# Altium project RK3576J-MB.PrjPCB (part 7 of 7)

## Sheet mPCIe_LoRa_LTE_RS.SchDoc
size 420 x 297 mm; Scale: 1:1; DocumentType: Схема электрическая принципиальная; SheetNumber: 15; SheetTotal: 23; DocumentTypeShort: Э3; DocumentInvertoryNumber: ㅤ
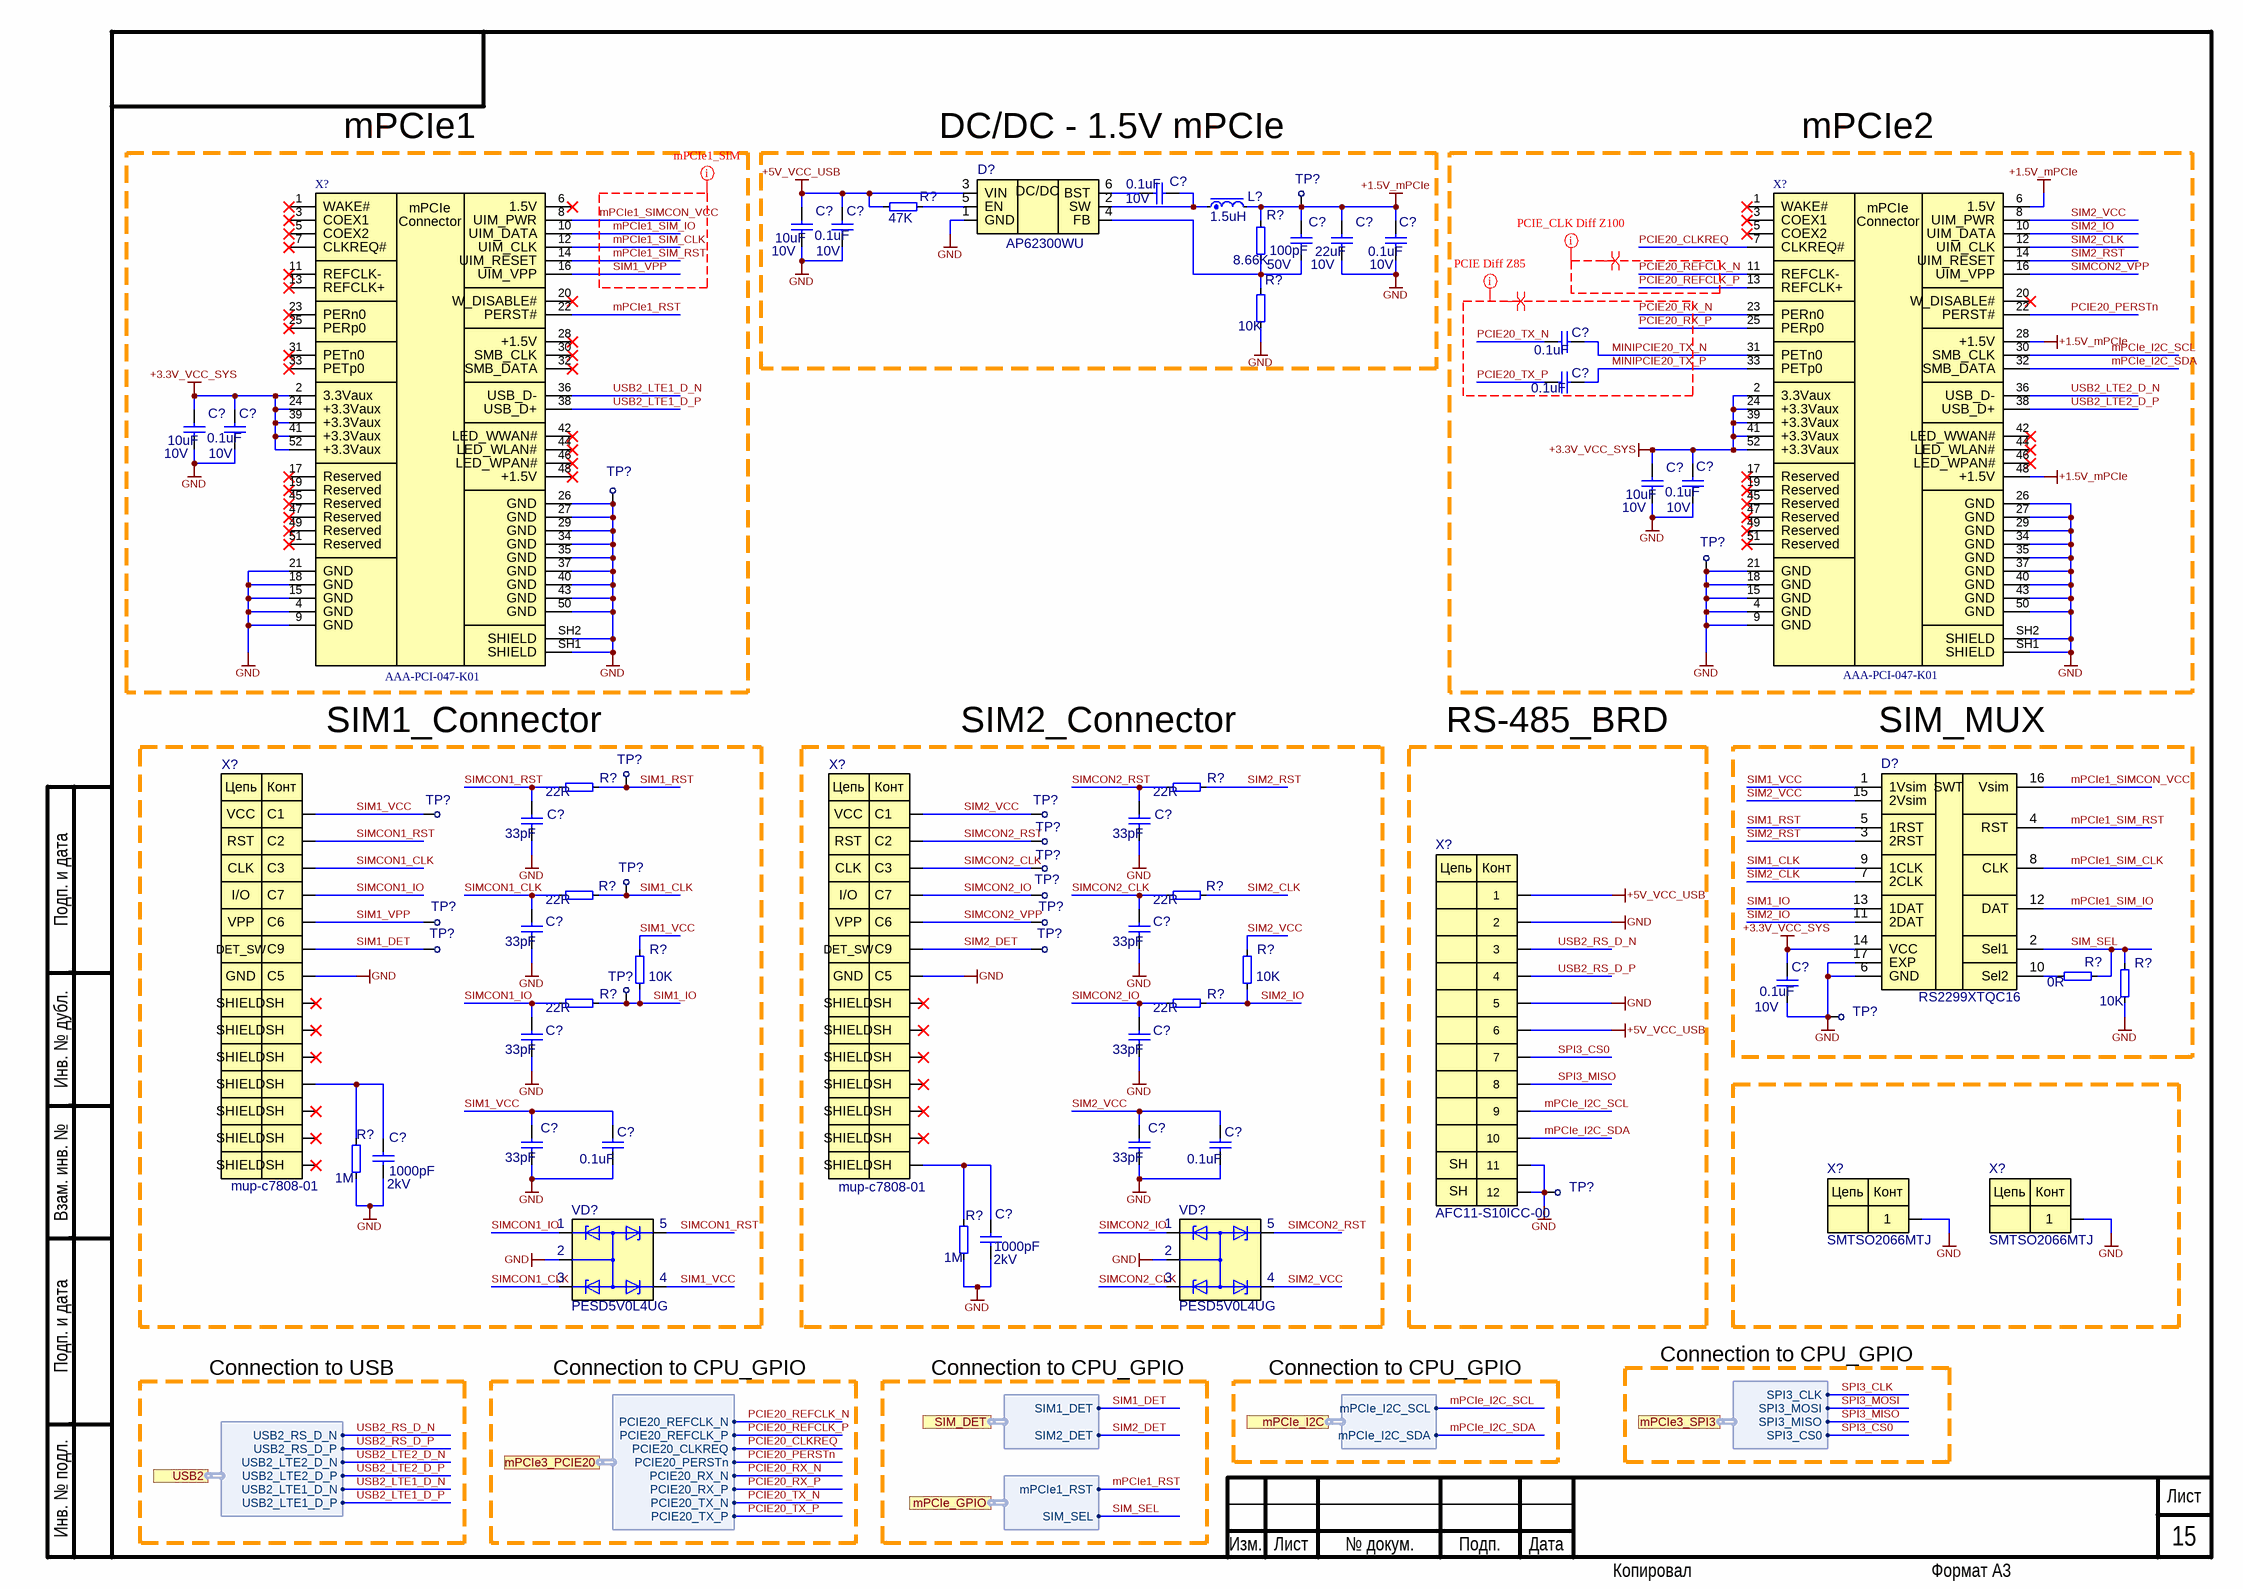
[diagram p23: mPCIe_LoRa_LTE_RS.SchDoc]

### Parts
(Parts that share a designator on the sheet are numbered #1, #2 ... from top to bottom, then left to right.)
C?#1  0.1uF  Voltage: 10V  [C0402]
C?#2  100pF  Voltage: 50V  [C0402]
C?#3  10uF  Voltage: 10V  [C0402]
C?#4  0.1uF  Voltage: 10V  [C0402]
C?#5  22uF  Voltage: 10V  [C0603]
C?#6  0.1uF  Voltage: 10V  [C0402]
C?#7  0.1uF  [C0201]
C?#8  0.1uF  [C0201]
C?#9  10uF  Voltage: 10V  [C0402]
C?#10  0.1uF  Voltage: 10V  [C0402]
C?#11  10uF  Voltage: 10V  [C0402]
C?#12  0.1uF  Voltage: 10V  [C0402]
C?#13  33pF  [C0402]
C?#14  33pF  [C0402]
C?#15  33pF  [C0402]
C?#16  33pF  [C0402]
C?#17  0.1uF  Voltage: 10V  [C0402]
C?#18  33pF  [C0402]
C?#19  33pF  [C0402]
C?#20  33pF  [C0402]
C?#21  0.1uF  [C0402]
C?#22  33pF  [C0402]
C?#23  0.1uF  [C0402]
C?#24  1000pF  Voltage: 2kV  [C1206]
C?#25  1000pF  Voltage: 2kV  [C1206]
D?#1  AP62300WU  [TSOT26]
D?#2  RS2299XTQC16  [RS2299XTQC16]
L?#1  1.5uH  [L1210]
R?#1  47K  [R_0402]
R?#2  8.66K  [R_0402]
R?#3  10K  [R_0402]
R?#4  22R  [R_0402]
R?#5  22R  [R_0402]
R?#6  22R  [R_0402]
R?#7  22R  [R_0402]
R?#8  0R  [R_0402]
R?#9  10K  [R_0402]
R?#10  10K  [R_0402]
R?#11  22R  [R_0402]
R?#12  22R  [R_0402]
R?#13  10K  [R_0402]
R?#14  1M  [R_1206]
R?#15  1M  [R_1206]
TP?#1  Тестовая точка  [TEST]  (value not drawn)  (no BOM)
TP?#2  Тестовая точка  [TEST]  (value not drawn)  (no BOM)
TP?#3  Тестовая точка  [TEST]  (value not drawn)  (no BOM)
TP?#4  Тестовая точка  [TEST]  (value not drawn)  (no BOM)
TP?#5  Тестовая точка  [TEST]  (value not drawn)  (no BOM)
TP?#6  Тестовая точка  [TEST]  (value not drawn)  (no BOM)
TP?#7  Тестовая точка  [TEST]  (value not drawn)  (no BOM)
TP?#8  Тестовая точка  [TEST]  (value not drawn)  (no BOM)
TP?#9  Тестовая точка  [TEST]  (value not drawn)  (no BOM)
TP?#10  Тестовая точка  [TEST]  (value not drawn)  (no BOM)
TP?#11  Тестовая точка  [TEST]  (value not drawn)  (no BOM)
TP?#12  Тестовая точка  [TEST]  (value not drawn)  (no BOM)
TP?#13  Тестовая точка  [TEST]  (value not drawn)  (no BOM)
TP?#14  Тестовая точка  [TEST]  (value not drawn)  (no BOM)
TP?#15  Тестовая точка  [TEST]  (value not drawn)  (no BOM)
TP?#16  Тестовая точка  [TEST]  (value not drawn)  (no BOM)
TP?#17  Тестовая точка  [TEST]  (value not drawn)  (no BOM)
VD?#1  PESD5V0L4UG  [TSSOP5-5]
VD?#2  PESD5V0L4UG  [TSSOP5-5]
X?#1  AAA-PCI-047-K01  [AAA-PCI-047-K01]
X?#2  AAA-PCI-047-K01  [AAA-PCI-047-K01]
X?#3  mup-c7808-01  [mup-c7808]
X?#4  mup-c7808-01  [mup-c7808]
X?#5  AFC11-S10ICC-00  [AFC11-S10ICC-00]
X?#6  SMTSO2066MTJ  [SMTSO2066MTJ]
X?#7  SMTSO2066MTJ  [SMTSO2066MTJ]

### Ports
mPCIe3_PCIE20 (harness mPCIe3_PCIE20), mPCIe3_SPI3 (harness mPCIe3_SPI3), mPCIe_GPIO (harness mPCIe_GPIO), mPCIe_I2C (harness mPCIe_I2C), SIM_DET (harness SIM_DET), USB2 (harness USB2)

### Harnesses
USB2: USB2_RS_D_P, USB2_RS_D_N, USB2_LTE2_D_P, USB2_LTE2_D_N, USB2_LTE1_D_P, USB2_LTE1_D_N
mPCIe3_PCIE20: PCIE20_REFCLK_P, PCIE20_REFCLK_N, PCIE20_RX_P, PCIE20_RX_N, PCIE20_TX_P, PCIE20_TX_N, PCIE20_PERSTn, PCIE20_CLKREQ
mPCIe_GPIO: SIM_SEL, mPCIe1_RST
SIM_DET: SIM1_DET, SIM2_DET
mPCIe_I2C: mPCIe_I2C_SDA, mPCIe_I2C_SCL
mPCIe3_SPI3: SPI3_MOSI, SPI3_CS0, SPI3_MISO, SPI3_CLK

### Nets
+1.5V_mPCIe: C?#2.1 C?#5.2 C?#6.2 L?#1.2 R?#2.2 TP?#1.1 X?#2.6(1.5V) X?#2.28(+1.5V) X?#2.48(+1.5V)
+3.3V_VCC_SYS: C?#9.2 C?#10.2 C?#11.2 C?#12.2 C?#17.2 D?#2.14(VCC) X?#1.2(3.3Vaux) X?#1.24(+3.3Vaux) X?#1.39(+3.3Vaux) X?#1.41(+3.3Vaux) X?#1.52(+3.3Vaux) X?#2.2(3.3Vaux) X?#2.24(+3.3Vaux) X?#2.39(+3.3Vaux) X?#2.41(+3.3Vaux) X?#2.52(+3.3Vaux)
+5V_VCC_USB: C?#3.2 C?#4.2 D?#1.3(VIN) R?#1.2 X?#5.1 X?#5.6
GND: C?#3.1 C?#4.1 C?#5.1 C?#6.1 C?#9.1 C?#10.1 C?#11.1 C?#12.1 C?#13.1 C?#14.1 C?#15.1 C?#16.1 C?#17.1 C?#18.1 C?#19.1 C?#20.1 C?#21.1 C?#22.1 C?#23.1 C?#24.1 C?#25.1 D?#1.1(GND) D?#2.6(GND) D?#2.17(EXP) R?#3.1 R?#13.1 R?#14.1 R?#15.1 TP?#2.1 TP?#3.1 TP?#16.1 TP?#17.1 VD?#1.2 VD?#2.2 X?#1.4(GND) X?#1.9(GND) X?#1.15(GND) X?#1.18(GND) X?#1.21(GND) X?#1.26(GND) X?#1.27(GND) X?#1.29(GND) X?#1.34(GND) X?#1.35(GND) X?#1.37(GND) X?#1.40(GND) X?#1.43(GND) X?#1.50(GND) X?#1.SH1(SHIELD) X?#1.SH2(SHIELD) X?#2.4(GND) X?#2.9(GND) X?#2.15(GND) X?#2.18(GND) X?#2.21(GND) X?#2.26(GND) X?#2.27(GND) X?#2.29(GND) X?#2.34(GND) X?#2.35(GND) X?#2.37(GND) X?#2.40(GND) X?#2.43(GND) X?#2.50(GND) X?#2.SH1(SHIELD) X?#2.SH2(SHIELD) X?#3.C5 X?#4.C5 X?#5.2 X?#5.5 X?#5.11 X?#5.12 X?#6.1 X?#7.1
MINIPCIE20_TX_N: C?#7.2 X?#2.31(PETn0)
MINIPCIE20_TX_P: C?#8.2 X?#2.33(РЕТр0)
mPCIe1_RST: X?#1.22(PERST#) ; port mPCIe_GPIO.mPCIe1_RST
mPCIe1_SIM_CLK: D?#2.8(CLK) X?#1.12(UIM_CLK)
mPCIe1_SIM_IO: D?#2.12(DAT) X?#1.10(UIM_DATA)
mPCIe1_SIM_RST: D?#2.4(RST) X?#1.14(UIM_RESET)
mPCIe1_SIMCON_VCC: D?#2.16(Vsim) X?#1.8(UIM_PWR)
mPCIe_I2C_SCL: X?#2.30(SMB_CLK) X?#5.9 ; port mPCIe_I2C.mPCIe_I2C_SCL
mPCIe_I2C_SDA: X?#2.32(SMB_DATA) X?#5.10 ; port mPCIe_I2C.mPCIe_I2C_SDA
PCIE20_CLKREQ: X?#2.7(CLKREQ#) ; port mPCIe3_PCIE20.PCIE20_CLKREQ
PCIE20_PERSTn: X?#2.22(PERST#) ; port mPCIe3_PCIE20.PCIE20_PERSTn
PCIE20_REFCLK_N: X?#2.11(REFCLK-) ; port mPCIe3_PCIE20.PCIE20_REFCLK_N
PCIE20_REFCLK_P: X?#2.13(REFCLK+) ; port mPCIe3_PCIE20.PCIE20_REFCLK_P
PCIE20_RX_N: X?#2.23(PERn0) ; port mPCIe3_PCIE20.PCIE20_RX_N
PCIE20_RX_P: X?#2.25(PERp0) ; port mPCIe3_PCIE20.PCIE20_RX_P
PCIE20_TX_N: C?#7.1 ; port mPCIe3_PCIE20.PCIE20_TX_N
PCIE20_TX_P: C?#8.1 ; port mPCIe3_PCIE20.PCIE20_TX_P
SIM1_CLK: D?#2.9(1CLK) R?#6.2 TP?#9.1
SIM1_DET: TP?#13.1 X?#3.C9 ; port SIM_DET.SIM1_DET
SIM1_IO: D?#2.13(1DAT) R?#9.1 R?#11.2 TP?#15.1
SIM1_RST: D?#2.5(1RST) R?#4.2 TP?#4.1
SIM1_VCC: C?#20.2 C?#21.2 D?#2.1(1Vsim) R?#9.2 TP?#5.1 VD?#1.4 X?#3.C1
SIM1_VPP: TP?#11.1 X?#1.16(UIM_VPP) X?#3.C6
SIM2_CLK: D?#2.7(2CLK) R?#7.2 X?#2.12(UIM_CLK)
SIM2_DET: TP?#14.1 X?#4.C9 ; port SIM_DET.SIM2_DET
SIM2_IO: D?#2.11(2DAT) R?#10.1 R?#12.2 X?#2.10(UIM_DATA)
SIM2_RST: D?#2.3(2RST) R?#5.2 X?#2.14(UIM_RESET)
SIM2_VCC: C?#22.2 C?#23.2 D?#2.15(2Vsim) R?#10.2 TP?#6.1 VD?#2.4 X?#2.8(UIM_PWR) X?#4.C1
SIM_SEL: D?#2.2(Sel1) R?#8.2 R?#13.2 ; port mPCIe_GPIO.SIM_SEL
SIMCON1_CLK: C?#15.2 R?#6.1 VD?#1.3 X?#3.C3
SIMCON1_IO: C?#18.2 R?#11.1 VD?#1.1 X?#3.C7
SIMCON1_RST: C?#13.2 R?#4.1 VD?#1.5 X?#3.C2
SIMCON2_CLK: C?#16.2 R?#7.1 TP?#8.1 VD?#2.3 X?#4.C3
SIMCON2_IO: C?#19.2 R?#12.1 TP?#10.1 VD?#2.1 X?#4.C7
SIMCON2_RST: C?#14.2 R?#5.1 TP?#7.1 VD?#2.5 X?#4.C2
SIMCON2_VPP: TP?#12.1 X?#2.16(UIM_VPP) X?#4.C6
SPI3_CLK: port mPCIe3_SPI3.SPI3_CLK
SPI3_CS0: X?#5.7 ; port mPCIe3_SPI3.SPI3_CS0
SPI3_MISO: X?#5.8 ; port mPCIe3_SPI3.SPI3_MISO
SPI3_MOSI: port mPCIe3_SPI3.SPI3_MOSI
USB2_LTE1_D_N: X?#1.36(USB_D-) ; port USB2.USB2_LTE1_D_N
USB2_LTE1_D_P: X?#1.38(USB_D+) ; port USB2.USB2_LTE1_D_P
USB2_LTE2_D_N: X?#2.36(USB_D-) ; port USB2.USB2_LTE2_D_N
USB2_LTE2_D_P: X?#2.38(USB_D+) ; port USB2.USB2_LTE2_D_P
USB2_RS_D_N: X?#5.3 ; port USB2.USB2_RS_D_N
USB2_RS_D_P: X?#5.4 ; port USB2.USB2_RS_D_P
NetC?#1_1: C?#1.1 D?#1.2(SW) L?#1.1
NetC?#1_2: C?#1.2 D?#1.6(BST)
NetC?#2_2: C?#2.2 D?#1.4(FB) R?#2.1 R?#3.2
NetC?#24_2: C?#24.2 R?#14.2 X?#3.SH4(SH)
NetC?#25_2: C?#25.2 R?#15.2 X?#4.SH7(SH)
NetD?#1_5: D?#1.5(EN) R?#1.1
NetD?#2_10: D?#2.10(Sel2) R?#8.1

Not connected (* = marked no-connect by the designer): X?#1 1(WAKE#)* 3(СОЕХ1)* 5(СОЕХ2)* 6(1.5V)* 7(CLKREQ#)* 11(REFCLK-)* 13(REFCLK+)* 17(Reserved)* 19(Reserved)* 20(W_DISABLE#)* 23(PERn0)* 25(PERp0)* 28(+1.5V)* 30(SMB_CLK)* 31(PETn0)* 32(SMB_DATA)* 33(РЕТр0)* 42(LED_WWAN#)* 44(LED_WLAN#)* 45(Reserved)* 46(LED_WPAN#)* 47(Reserved)* 48(+1.5V)* 49(Reserved)* 51(Reserved)*; X?#2 1(WAKE#)* 3(СОЕХ1)* 5(СОЕХ2)* 17(Reserved)* 19(Reserved)* 20(W_DISABLE#)* 42(LED_WWAN#)* 44(LED_WLAN#)* 45(Reserved)* 46(LED_WPAN#)* 47(Reserved)* 49(Reserved)* 51(Reserved)*; X?#3 SH1(SH)* SH2(SH)* SH3(SH)* SH5(SH)* SH6(SH)* SH7(SH)*; X?#4 SH1(SH)* SH2(SH)* SH3(SH)* SH4(SH)* SH5(SH)* SH6(SH)*

### Layout directives
net class mPCIe1_SIM: mPCIe1_SIM_CLK, mPCIe1_SIM_IO, mPCIe1_SIM_RST, mPCIe1_SIMCON_VCC, SIM1_VPP
rule Differential Pairs Routing [Pref Gap = 0.127mm    Min Gap  = 0.127mm    Max Gap  = 0.127mmPref Width = 0.12mm    Min Width  = 0.12mm    Max Width  = 0.14mm]; net class PCIE_Z85: MINIPCIE20_TX_N, MINIPCIE20_TX_P, PCIE20_RX_N, PCIE20_RX_P, PCIE20_TX_N, PCIE20_TX_P
differential pair: MINIPCIE20_TX_N, MINIPCIE20_TX_P, PCIE20_REFCLK_N, PCIE20_REFCLK_P, PCIE20_RX_N, PCIE20_RX_P, PCIE20_TX_N, PCIE20_TX_P
rule Differential Pairs Routing [Pref Gap = 0.2mm    Min Gap  = 0.127mm    Max Gap  = 0.24mmPref Width = 0.11mm    Min Width  = 0.1mm    Max Width  = 0.12mm]; net class PCIE_CLK: PCIE20_REFCLK_N, PCIE20_REFCLK_P

### Notes on the sheet
- mPCIe1
- DC/DC - 1.5V mPCIe
- mPCIe2
- SIM1_Connector
- SIM2_Connector
- RS-485_BRD
- SIM_MUX
- Connection to USB
- Connection to CPU_GPIO
- Подп. и дата
- Инв. № дубл.
- Взам. инв. №
- Инв. № подл.
- Изм.
- Лист
- № докум.
- Подп.
- Дата
- Копировал
- Формат А3
- (in symbol AAA-PCI-047-K01) mPCIe; Connector
- (in symbol AFC11-S10ICC-00) Цепь; Конт; SH
- (in symbol AP62300WU) DC/DC
- (in symbol mup-c7808) Цепь; Конт; VCC; RST; CLK; I/O; VPP; DET_SW; GND; SHIELD
- (in symbol RS2299XTQC16) SWT
- (in symbol SMTSO2066MTJ) Цепь; Конт

### Library data of the parts
C?#1 C?#4 C?#6 C?#10 C?#12 C?#17 = 0402-X7R-16V-0.1uF±10%: Part Number: 0402-X5R-10V-0.1uF±10%; Manufacturer: Yageo; NameFromManufacturer: CC0402KRX5R6BB104; Place: S; Tolerance: 10%; Check: False; Value: 0.1uF; Temperature: -55°C~125°C; ComponentLink2Description: Link to datasheet; ComponentLink1Description: DATASHEET; Last changed: 27.10.2022
C?#2 = 0402-NP0-50V-100pF±5%: *; Manufacturer: Yageo; NameFromManufacturer: CC0402JRNPO9BN101; Place: S; Tolerance: 5%; Check: False; Part Number: 0402-NP0-50V-100pF±5%; Value: 100pF; Temperature: -55°C~125°C; ComponentLink2Description: Link to datasheet; ComponentLink1Description: DATASHEET; ComponentLink2URL: https://www.terraelectronica.ru/product/367375; ComponentLink1URL: Datasheets/capacitors/UPY-GP_NP0_16V-to-50V_18.pdf; Last changed: 27.10.2022
C?#3 C?#9 C?#11 = 0402-X5R-10V-10uF±20: *; Manufacturer: Samsung; NameFromManufacturer: CL05A106MP5NUNC; Place: S; Tolerance: 20%; Check: False; Part Number: 0402-X5R-10V-10uF±20; Value: 10uF; Temperature: -55°C~85°C; ComponentLink2Description: Link to datasheet; ComponentLink1Description: DATASHEET; Last changed: 06.04.2023
C?#5 = 0603-X5R-10V-22uF±20%: *; Manufacturer: Murata; NameFromManufacturer: GRM188R61A226ME15D; Place: S; Tolerance: 20%; Part Number: 0603-X5R-10V-22uF±20%; Value: 22uF; Temperature: -55°C~85°C; ComponentLink2Description: Link to datasheet; ComponentLink1Description: DATASHEET
C?#7 C?#8 = 0201-X5R-25V-0.1uF±10%: Manufacturer: Yageo; NameFromManufacturer: CC0201KRX5R8BB104; Place: S; Voltage: 25V; Tolerance: 10%; Check: False; Part Number: 0201-X5R-25V-0.1uF±10%; Value: 0.1uF; Temperature: -55°C~85°C; ComponentLink2Description: Link to datasheet; ComponentLink1Description: DATASHEET; ComponentLink2URL: https://octopart.com/cc0201krx5r8bb104-yageo-88496683?r=sp; ComponentLink1URL: Datasheets/capacitors/UPY-GPHC_X5R_4V-to-50V_26.pdf; Last changed: 27.10.2022
C?#13-C?#16 C?#18-C?#20 C?#22 = 0402-NP0-50V-033pF±5%: Manufacturer: Yageo; NameFromManufacturer: CC0402JRNPO9BN330; Place: S; Voltage: 50V; Tolerance: 5%; Check: False; Annotation: *; Param: *; Value: 33pF; Part Number: 0402-NP0-50V-033pF±5%; Temperature: -55°C~125°C; ComponentLink1Description: DATASHEET; ComponentLink1URL: https://ru.mouser.com/ProductDetail/YAGEO/CC0402JRNPO9BN330?qs=%2Fha2pyFadugad28DmURO4SjHY55hse1%2FbIxH0hu%252BjwDDDqlPhfn26g%3D%3D; Datasheet: #https://www.yageo.com/upload/media/product/productsearch/datasheet/mlcc/UPY-GP_NP0_16V-to-50V_18.pdf#; Last changed: 07.10.2021
C?#21 C?#23 = 0402-X7R-16V-0.1uF±10%: Manufacturer: Yageo; NameFromManufacturer: CC0402JRX7R7BB104; Place: S; Voltage: 16V; Tolerance: 10%; Check: False; Annotation: *; Param: *; Value: 0.1uF; Part Number: 0402-X7R-16V-0.1uF±10%; Temperature: -55°C~125°C; ComponentLink1Description: DATASHEET; ComponentLink1URL: https://www.yageo.com/upload/media/product/productsearch/datasheet/mlcc/UPY-GPHC_X7R_6.3V-to-50V_18.pdf; Datasheet: #https://www.yageo.com/upload/media/product/productsearch/datasheet/mlcc/UPY-GPHC_X7R_6.3V-to-50V_18.pdf#; Last changed: 31.03.2021
C?#24 C?#25 = 1206-X7R-2K-1000pF±10%: Manufacturer: Walsin; NameFromManufacturer: 1206B102K202; Place: S; Tolerance: 10%; Check: False; Part Number: 1206-X7R-2K-1000pF±10%; Value: 1000pF; Temperature: -55°C~125°C; ComponentLink2Description: Link to datasheet; ComponentLink1Description: DATASHEET; ComponentLink2URL: https://www.lcsc.com/product-detail/Multilayer-Ceramic-Capacitors-MLCC-SMD-SMT_Walsin-Tech-Corp-1206B102K202_C77494.html; ComponentLink1URL: Datasheets/capacitors/1810261813_Walsin-Tech-Corp-1206B102K202_C77494.pdf#Datasheets/capacitors/1810261813_Walsin-Tech-Corp-1206B102K202_C77494.pdf#; Last changed: 05.12.2022
D?#1 = AP62300WU: 4.2V TO 18V INPUT, 3A LOW IQ SYNCHRONOUS BUCK CONVERTER; Manufacturer: Diodes Incorporated; Place: S; Check: False; Part Number: AP62300WU; Value: AP62300WU; Temperature: -40°C~125°C; NameFromManufacturer: AP62300WU; ComponentLink1Description: DATASHEET; ComponentLink1URL: https://ru.mouser.com/ProductDetail/Diodes-Incorporated/AP62300WU-7?qs=vHuUswq2%252Bsy87v186OJS%2FQ%3D%3D; Datasheet: Datasheets/power/AP62300_AP62301_AP62300T.pdf; Last changed: 27.10.2022
D?#2 = RS2299XTQC16: Analog Switches; Manufacturer: RUNIC Tech; Check: False; Part Number: RS2299XTQC16; Value: RS2299XTQC16; NameFromManufacturer: RS2299XTQC16
L?#1 = 1210-1A-1.5uH±20%: *; Manufacturer: Taiyo Yuden; NameFromManufacturer: LBC3225T1R5MR; Place: S; Tolerance: 20%; Current: 1A; DC Resistance: 0.060R; Check: False; Part Number: 1210-1A-1.5uH±20%; Value: 1.5uH; Temperature: -40°C~105°C; ComponentLink1Description: DATASHEET; ComponentLink1URL: https://www.electronshik.ru/item/TAIYO/LBC3225T1R5MR; Datasheet: Datasheets/inductors/LSQCA322525T1R5MRSS.pdf; Last changed: 27.10.2022
R?#1 = 0402-0.0625W-47K-100ppm±1%: NameFromManufacturer: RC0402FR-0747KL; Manufacturer: Yageo; Place: S; Tolerance: 1%; Check: False; Part Number: 0402-0.0625W-47K-100ppm±1%; Value: 47K; Temperature: -55°C~155°C; ComponentLink1Description: DATASHEET; ComponentLink1URL: https://www.terraelectronica.ru/pdf/show?pdf_file=%252Fds%252Fpdf%252FR%252FRC0402.pdf; Datasheet: Datasheets/resistors/PYu-RC_Group_51_RoHS_L_12.pdf; Last changed: 27.10.2022
R?#2 = 0402-0.0625W-48.7K-100ppm±1%: Part Number: 0402-0.0625W-8.66K-100ppm±1%; NameFromManufacturer: RC0402FR-078K66L; Manufacturer: Yageo; Place: S; Tolerance: 1%; Check: False; Value: 8.66K; Temperature: -55°C~155°C; ComponentLink1Description: DATASHEET; ComponentLink1URL: https://www.terraelectronica.ru/product/1871035; Datasheet: Datasheets/resistors/PYu-RC_Group_51_RoHS_L_12.pdf; Last changed: 27.10.2022
R?#3 = 0402-0.0625W-10K-100ppm±1%: NameFromManufacturer: RC0402FR-0710KL; Manufacturer: Yageo; Place: S; Tolerance: 1%; Check: False; Part Number: 0402-0.0625W-10K-100ppm±1%; Value: 10K; Temperature: -55°C~155°C; ComponentLink1Description: DATASHEET; ComponentLink1URL: https://ru.mouser.com/ProductDetail/YAGEO/RC0402FR-0710KL?qs=%2Fha2pyFaduhjtLcYvKXQ8IogF7YwN7YtH%252BOO8ZtEEMnoa4yoWYcwpw%3D%3D; Datasheet: Datasheets/resistors/PYu-RC_Group_51_RoHS_L_11.pdf; Last changed: 27.10.2022
R?#4-R?#7 R?#11 R?#12 = 0402-0.0625W-22R-100ppm±1%: NameFromManufacturer: RC0402FR-0722RL; Manufacturer: Yageo; Place: S; Tolerance: 1%; Check: False; Annotation: *; Param: *; Value: 22R; Part Number: 0402-0.0625W-22R-100ppm±1%; Temperature: -55°C~155°C; ComponentLink1Description: DATASHEET; ComponentLink1URL: https://www.yageo.com/upload/media/product/productsearch/datasheet/rchip/PYu-RC_Group_51_RoHS_L_11.pdf; Datasheet: #https://www.yageo.com/upload/media/product/productsearch/datasheet/rchip/PYu-RC_Group_51_RoHS_L_11.pdf#; Last changed: 10.06.2021
R?#8 = 0402-0.0625W-0R-100ppm±1%: NameFromManufacturer: RC0402FR-070RL; Manufacturer: Yageo; Place: S; Tolerance: 1%; Check: False; Part Number: 0402-0.0625W-0R-100ppm±1%; Value: 0R; Temperature: -55°C~155°C; ComponentLink1Description: DATASHEET; ComponentLink1URL: https://www.chipdip.ru/product0/8000617426?ysclid=l7og5x0plo427794326; Datasheet: Datasheets/resistors/DOC012445956.pdf; Last changed: 27.10.2022
R?#9 R?#10 R?#13 = 0402-0.0625W-10K-100ppm±5%: NameFromManufacturer: RC0402JR-0710KL; Manufacturer: Yageo; Place: S; Tolerance: 5%; Check: False; Annotation: *; Param: *; Value: 10K; Part Number: 0402-0.0625W-10K-100ppm±5%; Temperature: -55°C~155°C; ComponentLink1Description: DATASHEET; ComponentLink1URL: https://ru.mouser.com/ProductDetail/YAGEO/RC0402JR-0710KL?qs=%2Fha2pyFadugNN0LzwXn2qF8HRAp201xOpXu%252BapQnyvRGE%2F%252Bpr1TWjQ%3D%3D; Datasheet: #https://www.yageo.com/upload/media/product/productsearch/datasheet/rchip/PYu-RC_Group_51_RoHS_L_11.pdf#; Last changed: 12.10.2021
R?#14 R?#15 = 1206-0.25W-0R-200ppm±1%: Part Number: 1206-0.25W-1M-200ppm±1%; NameFromManufacturer: RC1206FR-071ML; Manufacturer: Yageo; Place: S; Tolerance: 1%; Check: False; Value: 1M; Temperature: -55°C~155°C; ComponentLink1Description: DATASHEET; ComponentLink1URL: https://www.yageo.com/upload/media/product/productsearch/datasheet/rchip/PYu-RC_Group_51_RoHS_L_11.pdf; Datasheet: Datasheets/resistors/PYu-RC_Group_51_RoHS_L_11.pdf; Last changed: 27.10.2022
TP?#1-TP?#17 = Тестовая точка: *; Check: False; Part Number: Тестовая точка; Value: Тестовая точка; ComponentLink1Description: DATASHEET; Manufacturer: *
VD?#1 VD?#2 = PESD5V0L4UG,115: Low capacitance unidirectional quadruple ESD protectiondiode arrays; Manufacturer: Tech Public Co.; Place: S; Check: False; Part Number: PESD5V0L4UG; Value: PESD5V0L4UG; Temperature: -65°C~150°C; ComponentLink1Description: DATASHEET; NameFromManufacturer: PESD5V0L4UG; ComponentLink1URL: https://ru.mouser.com/datasheet/2/916/PESDXL4UF_G_W-1599806.pdf; Last changed: 09.08.2021
  VD?#2: Datasheet: #https://ru.mouser.com/datasheet/2/916/PESDXL4UF_G_W-1599806.pdf#
X?#1 X?#2 = AAA-PCI-047-K01: mPCI-E Surface Mount 52 SMD,P=0.8mm Card Edge Connectors; Manufacturer: LOTES; Place: S; Check: False; Value: AAA-PCI-047-K01; Part Number: AAA-PCI-047-K01; NameFromManufacturer: AAA-PCI-047-K01; ComponentLink1Description: DATASHEET; Last changed: 24.03.2023
X?#3 X?#4 = mup-c7808: Manufacturer: MUP; Check: False; Part Number: mup-c7808-01; Value: mup-c7808-01; NameFromManufacturer: mup-c7808-01
X?#5 = AFC11-S10ICC-00: Manufacturer: JUSHUO; Check: False; Part Number: AFC11-S10ICC-00; Value: AFC11-S10ICC-00; NameFromManufacturer: AFC11-S10ICC-00
X?#6 X?#7 = SMTSO2066MTJ: Manufacturer: Sinhoo; Check: False; Part Number: SMTSO2066MTJ; Value: SMTSO2066MTJ; NameFromManufacturer: SMTSO2066MTJ

## Sheet PCIE3.SchDoc
size 420 x 297 mm; Scale: 1:1; DocumentType: Схема электрическая принципиальная; SheetNumber: 16; SheetTotal: 23; DocumentTypeShort: Э3; DocumentInvertoryNumber: ㅤ
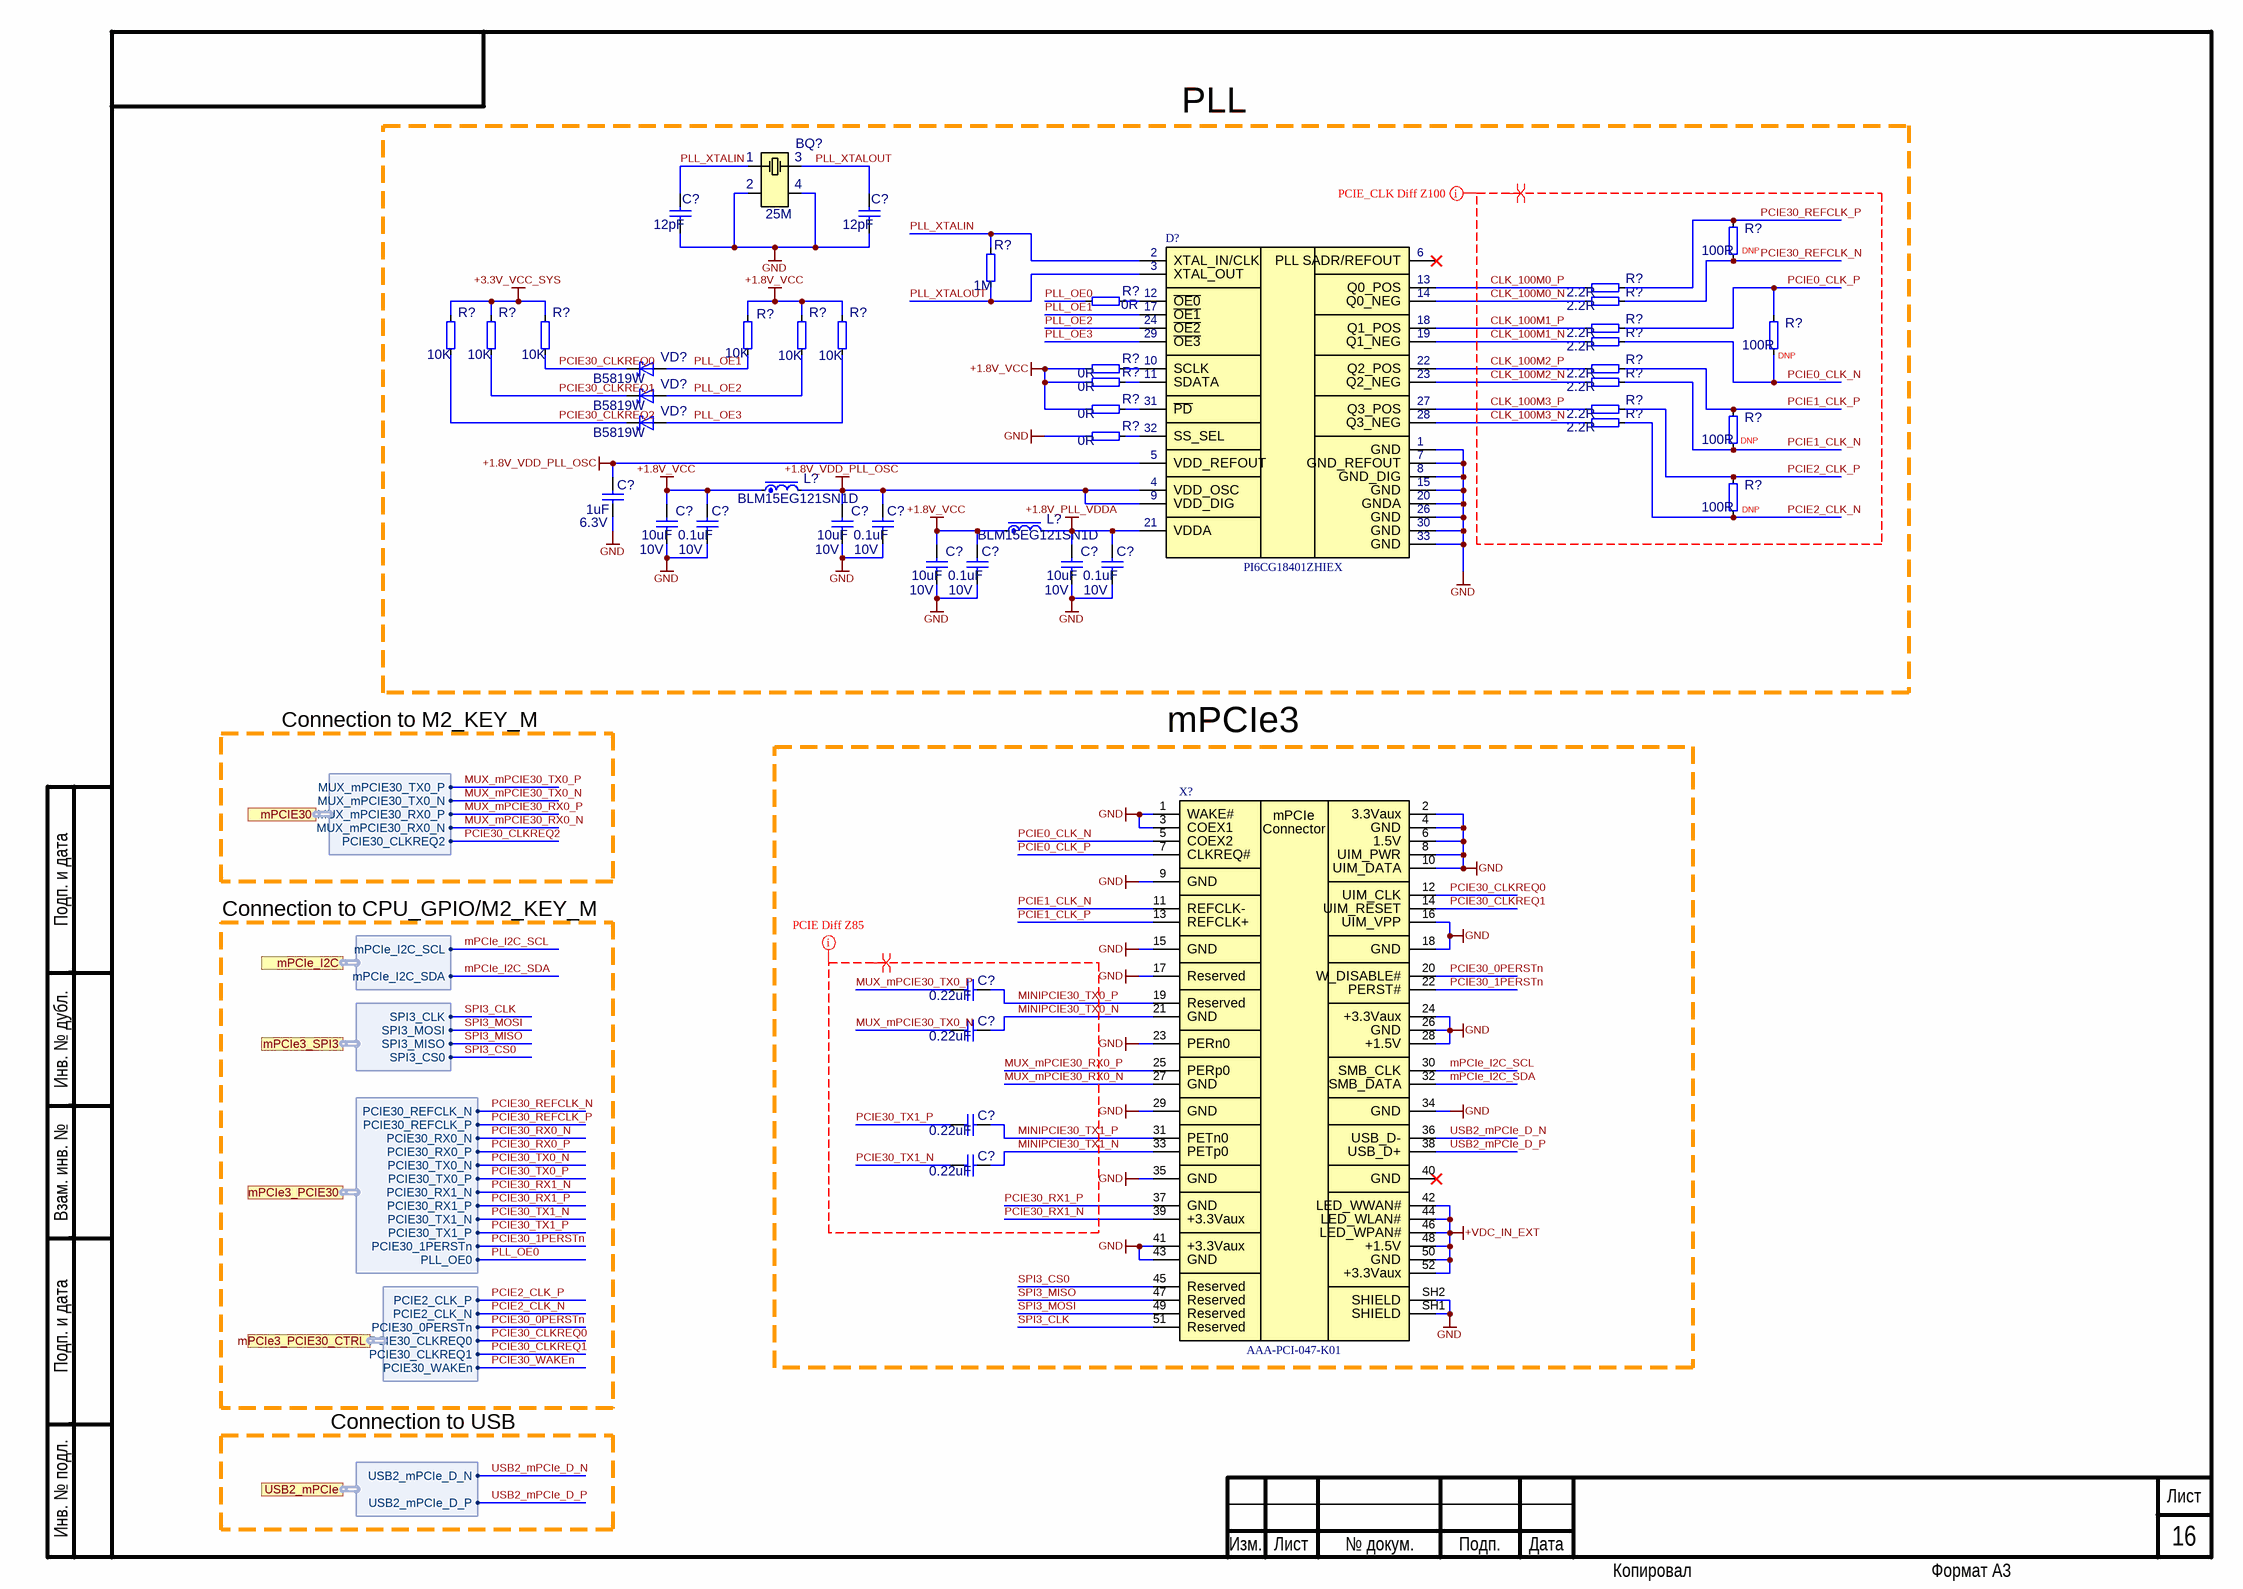
[diagram p24: PCIE3.SchDoc]

### Parts
(Parts that share a designator on the sheet are numbered #1, #2 ... from top to bottom, then left to right.)
BQ?  25M  [NX3225GA]
C?#26  12pF  [C0402]
C?#27  12pF  [C0402]
C?#28  1uF  Voltage: 6.3V  [C0402]
C?#29  10uF  Voltage: 10V  [C0402]
C?#30  0.1uF  Voltage: 10V  [C0402]
C?#31  10uF  Voltage: 10V  [C0402]
C?#32  0.1uF  Voltage: 10V  [C0402]
C?#33  10uF  Voltage: 10V  [C0402]
C?#34  0.1uF  Voltage: 10V  [C0402]
C?#35  10uF  Voltage: 10V  [C0402]
C?#36  0.1uF  Voltage: 10V  [C0402]
C?#37  0.22uF  [C0402]
C?#38  0.22uF  [C0402]
C?#39  0.22uF  [C0402]
C?#40  0.22uF  [C0402]
D?#3  PI6CG18401ZHIEX  [PI6CG18401ZHIEX]
L?#2  BLM15EG121SN1D  [L0402]
L?#3  BLM15EG121SN1D  [L0402]
R?#16  100R  [R_0402]
R?#17  1M  [R_0402]
R?#18  2.2R  [R_0402]
R?#19  0R  [R_0402]
R?#20  2.2R  [R_0402]
R?#21  10K  [R_0402]
R?#22  10K  [R_0402]
R?#23  10K  [R_0402]
R?#24  10K  [R_0402]
R?#25  10K  [R_0402]
R?#26  10K  [R_0402]
R?#27  2.2R  [R_0402]
R?#28  2.2R  [R_0402]
R?#29  100R  [R_0402]
R?#30  0R  [R_0402]
R?#31  2.2R  [R_0402]
R?#32  0R  [R_0402]
R?#33  2.2R  [R_0402]
R?#34  0R  [R_0402]
R?#35  2.2R  [R_0402]
R?#36  2.2R  [R_0402]
R?#37  0R  [R_0402]
R?#38  100R  [R_0402]
R?#39  100R  [R_0402]
VD?#3  B5819W  [B5819W]
VD?#4  B5819W  [B5819W]
VD?#5  B5819W  [B5819W]
X?#8  AAA-PCI-047-K01  [AAA-PCI-047-K01]

### Ports
mPCIe3_PCIE30 (harness mPCIe3_PCIE30), mPCIe3_PCIE30_CTRL (harness mPCIe3_PCIE30_CTRL), mPCIe3_SPI3 (harness mPCIe3_SPI3), mPCIE30 (harness mPCIE30), mPCIe_I2C (harness mPCIe_I2C), USB2_mPCIe (harness USB2_mPCIe)

### Harnesses
USB2_mPCIe: USB2_mPCIe_D_P, USB2_mPCIe_D_N
mPCIe3_SPI3: SPI3_MOSI, SPI3_CS0, SPI3_MISO, SPI3_CLK
mPCIe_I2C: mPCIe_I2C_SDA, mPCIe_I2C_SCL
mPCIE30: MUX_mPCIE30_TX0_N, MUX_mPCIE30_RX0_N, MUX_mPCIE30_RX0_P, MUX_mPCIE30_TX0_P, PCIE30_CLKREQ2
mPCIe3_PCIE30: PCIE30_REFCLK_P, PCIE30_REFCLK_N, PCIE30_RX1_P, PCIE30_RX1_N, PCIE30_TX1_N, PCIE30_TX1_P, PCIE30_RX0_P, PCIE30_RX0_N, PCIE30_TX0_N, PCIE30_TX0_P, PCIE30_1PERSTn, PLL_OE0
mPCIe3_PCIE30_CTRL: PCIE30_WAKEn, PCIE30_CLKREQ1, PCIE30_CLKREQ0, PCIE30_0PERSTn, PCIE2_CLK_N, PCIE2_CLK_P

### Nets
+1.8V_PLL_VDDA: C?#35.2 C?#36.2 D?#3.21(VDDA) L?#3.2
+1.8V_VCC: C?#29.2 C?#30.2 C?#33.2 C?#34.2 L?#2.1 L?#3.1 R?#24.1 R?#25.1 R?#26.1 R?#30.1 R?#32.1 R?#34.1
+1.8V_VDD_PLL_OSC: C?#28.2 C?#31.2 C?#32.2 D?#3.4(VDD_OSC) D?#3.5(VDD_REFOUT) D?#3.9(VDD_DIG) L?#2.2
+3.3V_VCC_SYS: R?#21.1 R?#22.1 R?#23.1
+VDC_IN_EXT: X?#8.42(LED_WWAN#) X?#8.44(LED_WLAN#) X?#8.46(LED_WPAN#) X?#8.48(+1.5V) X?#8.50(GND) X?#8.52(+3.3Vaux)
GND: BQ?.2 BQ?.4 C?#26.1 C?#27.1 C?#28.1 C?#29.1 C?#30.1 C?#31.1 C?#32.1 C?#33.1 C?#34.1 C?#35.1 C?#36.1 D?#3.1(GND) D?#3.7(GND_REFOUT) D?#3.8(GND_DIG) D?#3.15(GND) D?#3.20(GNDA) D?#3.26(GND) D?#3.30(GND) D?#3.33(GND) R?#37.1 X?#8.1(WAKE#) X?#8.2(3.3Vaux) X?#8.3(СОЕХ1) X?#8.4(GND) X?#8.6(1.5V) X?#8.8(UIM_PWR) X?#8.9(GND) X?#8.10(UIM_DATA) X?#8.15(GND) X?#8.16(UIM_VPP) X?#8.17(Reserved) X?#8.18(GND) X?#8.23(PERn0) X?#8.24(+3.3Vaux) X?#8.26(GND) X?#8.28(+1.5V) X?#8.29(GND) X?#8.34(GND) X?#8.35(GND) X?#8.41(+3.3Vaux) X?#8.43(GND) X?#8.SH1(SHIELD) X?#8.SH2(SHIELD)
CLK_100M0_N: D?#3.14(Q0_NEG) R?#20.1
CLK_100M0_P: D?#3.13(Q0_POS) R?#18.1
CLK_100M1_N: D?#3.19(Q1_NEG) R?#28.1
CLK_100M1_P: D?#3.18(Q1_POS) R?#27.1
CLK_100M2_N: D?#3.23(Q2_NEG) R?#33.1
CLK_100M2_P: D?#3.22(Q2_POS) R?#31.1
CLK_100M3_N: D?#3.28(Q3_NEG) R?#36.1
CLK_100M3_P: D?#3.27(Q3_POS) R?#35.1
MINIPCIE30_TX0_N: C?#38.2 X?#8.21(GND)
MINIPCIE30_TX0_P: C?#37.2 X?#8.19(Reserved)
MINIPCIE30_TX1_N: C?#40.2 X?#8.33(РЕТр0)
MINIPCIE30_TX1_P: C?#39.2 X?#8.31(PETn0)
mPCIe_I2C_SCL: X?#8.30(SMB_CLK) ; port mPCIe_I2C.mPCIe_I2C_SCL
mPCIe_I2C_SDA: X?#8.32(SMB_DATA) ; port mPCIe_I2C.mPCIe_I2C_SDA
MUX_mPCIE30_RX0_N: X?#8.27(GND) ; port mPCIE30.MUX_mPCIE30_RX0_N
MUX_mPCIE30_RX0_P: X?#8.25(PERp0) ; port mPCIE30.MUX_mPCIE30_RX0_P
MUX_mPCIE30_TX0_N: C?#38.1 ; port mPCIE30.MUX_mPCIE30_TX0_N
MUX_mPCIE30_TX0_P: C?#37.1 ; port mPCIE30.MUX_mPCIE30_TX0_P
PCIE0_CLK_N: R?#28.2 R?#29.1 X?#8.5(СОЕХ2)
PCIE0_CLK_P: R?#27.2 R?#29.2 X?#8.7(CLKREQ#)
PCIE1_CLK_N: R?#33.2 R?#38.1 X?#8.11(REFCLK-)
PCIE1_CLK_P: R?#31.2 R?#38.2 X?#8.13(REFCLK+)
PCIE2_CLK_N: R?#36.2 R?#39.1 ; port mPCIe3_PCIE30_CTRL.PCIE2_CLK_N
PCIE2_CLK_P: R?#35.2 R?#39.2 ; port mPCIe3_PCIE30_CTRL.PCIE2_CLK_P
PCIE30_0PERSTn: X?#8.20(W_DISABLE#) ; port mPCIe3_PCIE30_CTRL.PCIE30_0PERSTn
PCIE30_1PERSTn: X?#8.22(PERST#) ; port mPCIe3_PCIE30.PCIE30_1PERSTn
PCIE30_CLKREQ0: R?#23.2 VD?#3.1(K) X?#8.12(UIM_CLK) ; port mPCIe3_PCIE30_CTRL.PCIE30_CLKREQ0
PCIE30_CLKREQ1: R?#22.2 VD?#4.1(K) X?#8.14(UIM_RESET) ; port mPCIe3_PCIE30_CTRL.PCIE30_CLKREQ1
PCIE30_CLKREQ2: R?#21.2 VD?#5.1(K) ; port mPCIE30.PCIE30_CLKREQ2
PCIE30_REFCLK_N: R?#16.1 R?#20.2 ; port mPCIe3_PCIE30.PCIE30_REFCLK_N
PCIE30_REFCLK_P: R?#16.2 R?#18.2 ; port mPCIe3_PCIE30.PCIE30_REFCLK_P
PCIE30_RX0_N: port mPCIe3_PCIE30.PCIE30_RX0_N
PCIE30_RX0_P: port mPCIe3_PCIE30.PCIE30_RX0_P
PCIE30_RX1_N: X?#8.39(+3.3Vaux) ; port mPCIe3_PCIE30.PCIE30_RX1_N
PCIE30_RX1_P: X?#8.37(GND) ; port mPCIe3_PCIE30.PCIE30_RX1_P
PCIE30_TX0_N: port mPCIe3_PCIE30.PCIE30_TX0_N
PCIE30_TX0_P: port mPCIe3_PCIE30.PCIE30_TX0_P
PCIE30_TX1_N: C?#40.1 ; port mPCIe3_PCIE30.PCIE30_TX1_N
PCIE30_TX1_P: C?#39.1 ; port mPCIe3_PCIE30.PCIE30_TX1_P
PCIE30_WAKEn: port mPCIe3_PCIE30_CTRL.PCIE30_WAKEn
PLL_OE0: R?#19.1 ; port mPCIe3_PCIE30.PLL_OE0
PLL_OE1: D?#3.17(~{OE1}) R?#24.2 VD?#3.2(A)
PLL_OE2: D?#3.24(~{OE2}) R?#25.2 VD?#4.2(A)
PLL_OE3: D?#3.29(~{OE3}) R?#26.2 VD?#5.2(A)
PLL_XTALIN: BQ?.1 C?#26.2 D?#3.2(XTAL_IN/CLK) R?#17.2
PLL_XTALOUT: BQ?.3 C?#27.2 D?#3.3(XTAL_OUT) R?#17.1
SPI3_CLK: X?#8.51(Reserved) ; port mPCIe3_SPI3.SPI3_CLK
SPI3_CS0: X?#8.45(Reserved) ; port mPCIe3_SPI3.SPI3_CS0
SPI3_MISO: X?#8.47(Reserved) ; port mPCIe3_SPI3.SPI3_MISO
SPI3_MOSI: X?#8.49(Reserved) ; port mPCIe3_SPI3.SPI3_MOSI
USB2_mPCIe_D_N: X?#8.36(USB_D-) ; port USB2_mPCIe.USB2_mPCIe_D_N
USB2_mPCIe_D_P: X?#8.38(USB_D+) ; port USB2_mPCIe.USB2_mPCIe_D_P
NetD?#3_10: D?#3.10(SCLK) R?#30.2
NetD?#3_11: D?#3.11(SDATA) R?#32.2
NetD?#3_12: D?#3.12(~{OE0}) R?#19.2
NetD?#3_31: D?#3.31(~{PD}) R?#34.2
NetD?#3_32: D?#3.32(SS_SEL) R?#37.2

Not connected (* = marked no-connect by the designer): D?#3 6(SADR/REFOUT)*; X?#8 40(GND)*

### Layout directives
differential pair: CLK_100M0_N, CLK_100M0_P, CLK_100M1_N, CLK_100M1_P, CLK_100M2_N, CLK_100M2_P, CLK_100M3_N, CLK_100M3_P, MINIPCIE30_TX0_N, MINIPCIE30_TX0_P, MINIPCIE30_TX1_N, MINIPCIE30_TX1_P, MUX_mPCIE30_RX0_N, MUX_mPCIE30_RX0_P, MUX_mPCIE30_TX0_N, MUX_mPCIE30_TX0_P, PCIE0_CLK_N, PCIE0_CLK_P, PCIE1_CLK_N, PCIE1_CLK_P, PCIE2_CLK_N, PCIE2_CLK_P, PCIE30_REFCLK_N, PCIE30_REFCLK_P, PCIE30_RX1_N, PCIE30_RX1_P, PCIE30_TX1_N, PCIE30_TX1_P
rule Differential Pairs Routing [Pref Gap = 0.127mm    Min Gap  = 0.127mm    Max Gap  = 0.127mmPref Width = 0.12mm    Min Width  = 0.12mm    Max Width  = 0.14mm]; net class PCIE_Z85: MINIPCIE30_TX0_N, MINIPCIE30_TX0_P, MINIPCIE30_TX1_N, MINIPCIE30_TX1_P, MUX_mPCIE30_RX0_N, MUX_mPCIE30_RX0_P, MUX_mPCIE30_TX0_N, MUX_mPCIE30_TX0_P, PCIE30_RX1_N, PCIE30_RX1_P, PCIE30_TX1_N, PCIE30_TX1_P
rule Differential Pairs Routing [Pref Gap = 0.2mm    Min Gap  = 0.127mm    Max Gap  = 0.24mmPref Width = 0.11mm    Min Width  = 0.1mm    Max Width  = 0.12mm]; net class PCIE_CLK: CLK_100M0_N, CLK_100M0_P, CLK_100M1_N, CLK_100M1_P, CLK_100M2_N, CLK_100M2_P, CLK_100M3_N, CLK_100M3_P, PCIE0_CLK_N, PCIE0_CLK_P, PCIE1_CLK_N, PCIE1_CLK_P, PCIE2_CLK_N, PCIE2_CLK_P, PCIE30_REFCLK_N, PCIE30_REFCLK_P

### Notes on the sheet
- PLL
- (near R?#16) DNP
- (near R?#29) DNP
- (near R?#38) DNP
- (near R?#39) DNP
- Connection to M2_KEY_M
- mPCIe3
- Connection to CPU_GPIO/M2_KEY_M
- Connection to USB
- Подп. и дата
- Инв. № дубл.
- Взам. инв. №
- Инв. № подл.
- Изм.
- Лист
- № докум.
- Подп.
- Дата
- Копировал
- Формат А3
- (in symbol AAA-PCI-047-K01) mPCIe; Connector
- (in symbol PI6CG18401ZHIEX) PLL

### Library data of the parts
BQ? = E3SB25E00000DE: 25MHz 10pF ±10ppm SMD3225-4P; Part Number: TAXM25M4RDBCCT2T; Manufacturer: Yajingxin; Place: S; Check: False; Value: 25M; Tolerance: 10ppm; NameFromManufacturer: TAXM25M4RDBCCT2T; Last changed: 18.04.2023
C?#26 C?#27 = 0402-NP0-50V-12pF±5%: Manufacturer: Murata Electronics; NameFromManufacturer: GRM1555C1H120JA01D; Place: S; Voltage: 50V; Tolerance: 5%; Check: False; Part Number: 0402-NP0-50V-12pF±5%; Value: 12pF; Temperature: -55°C~125°C; ComponentLink2Description: Link to datasheet; ComponentLink1Description: DATASHEET; ComponentLink2URL: https://www.terraelectronica.ru/pdf/show?pdf_file=http%253A%252F%252Fwww.farnell.com%252Fdatasheets%252F2048662.pdf; ComponentLink1URL: Datasheets/capacitors/GRM1555C1H120JA01-01A.pdf; Last changed: 27.10.2022
C?#28 = 0402-X7R-6.3V-1uF±10%: Manufacturer: Yageo; NameFromManufacturer: CC0402KRX7R5BB105; Place: S; Tolerance: 10%; Check: False; Part Number: 0402-X7R-6.3V-1uF±10%; Value: 1uF; Temperature: -55°C~125°C; ComponentLink2Description: Link to datasheet; ComponentLink1Description: DATASHEET; ComponentLink2URL: https://www.terraelectronica.ru/product/1352679; ComponentLink1URL: Datasheets/capacitors/UPY-GPHC_X7R_6.3V-to-50V_20.pdf; Last changed: 27.10.2022
C?#29 C?#31 C?#33 C?#35 = 0402-X5R-10V-10uF±20: as C?#3 on sheet mPCIe_LoRa_LTE_RS; Part Number: 0402-X5R-10V-10uF±20; Value: 10uF; Temperature: -55°C~85°C; ComponentLink2Description: Link to datasheet; ComponentLink1Description: DATASHEET; Last changed: 06.04.2023
C?#30 C?#32 C?#34 C?#36 = 0402-X7R-16V-0.1uF±10%: as C?#1 on sheet mPCIe_LoRa_LTE_RS; Value: 0.1uF; Temperature: -55°C~125°C; ComponentLink2Description: Link to datasheet; ComponentLink1Description: DATASHEET; Last changed: 27.10.2022
C?#37-C?#40 = 0402-X5R-6.3V-0.22uF±10%: Manufacturer: Yageo; NameFromManufacturer: CC0402KRX5R5BB224; Place: S; Voltage: 6.3V; Tolerance: 10%; Check: False; Part Number: 0402-X5R-6.3V-0.22uF±10%; Value: 0.22uF; Temperature: -55°C~125°C; ComponentLink2Description: Link to datasheet; ComponentLink1Description: DATASHEET; ComponentLink2URL: https://www.digikey.com/en/products/detail/yageo/CC0402KRX5R5BB224/5195090?s=N4IgTCBcDaIMJwAwBZFgNICUAaBWTuAQoWGMiALoC%2BQA; ComponentLink1URL: Datasheets/capacitors/UPY-GPHC_X5R_4V-to-50V_26.pdf; Last changed: 27.10.2022
D?#3 = PI6CG18401ZHIEX: Clock Generator 25MHz-IN 100MHz-OUT 32-Pin TQFN EP T/R; Manufacturer: Diodes Incorporated; Check: False; Part Number: PI6CG18401ZHIEX; NameFromManufacturer: PI6CG18401ZHIEX; Value: PI6CG18401ZHIEX
L?#2 L?#3 = BLM15EG121SN1D: 120Ω@100MHz  Ferrite Beads; Manufacturer: Murata Electronics; Place: S; Tolerance: 25%; DC Resistance: 0.095R; Check: False; Analog: UPZ1005D121-1R3TF, CBW100505U121T; Part Number: BLM15EG121SN1D; Value: BLM15EG121SN1D; Temperature: -40°C~85°C; NameFromManufacturer: BLM15EG121SN1D; Last changed: 18.04.2023
R?#16 R?#29 R?#38 R?#39 = 0402-0.0625W-100R-100ppm±1%: NameFromManufacturer: RC0402FR-07100RL; Manufacturer: Yageo; Place: S; Tolerance: 1%; Check: False; Part Number: 0402-0.0625W-100R-100ppm±1%; Value: 100R; Temperature: -55°C~155°C; ComponentLink1Description: DATASHEET; ComponentLink1URL: https://www.yageo.com/upload/media/product/productsearch/datasheet/rchip/PYu-RC_Group_51_RoHS_L_11.pdf; Datasheet: Datasheets/resistors/PYu-RC_Group_51_RoHS_L_11.pdf; Last changed: 27.10.2022
R?#17 = 0402-0.0625W-1M-100ppm±1%: NameFromManufacturer: RC0402FR-071ML; Manufacturer: Yageo; Place: S; Tolerance: 1%; Check: False; Part Number: 0402-0.0625W-1M-100ppm±1%; Value: 1M; Temperature: -55°C~155°C; ComponentLink1Description: DATASHEET; ComponentLink1URL: https://www.yageo.com/upload/media/product/productsearch/datasheet/rchip/PYu-RC_Group_51_RoHS_L_11.pdf; Datasheet: Datasheets/resistors/PYu-RC_Group_51_RoHS_L_11.pdf; Last changed: 27.10.2022
R?#18 R?#20 R?#27 R?#28 R?#31 R?#33 R?#35 R?#36 = 0402-0.0625W-0R-100ppm±1%: Part Number: 0402-0.0625W-2.2R-100ppm±1%; NameFromManufacturer: RC0402FR-072R2L; Manufacturer: Yageo; Place: S; Tolerance: 1%; Check: False; Value: 2.2R; Temperature: -55°C~155°C; ComponentLink1Description: DATASHEET; Datasheet: Datasheets/resistors/DOC012445956.pdf; Last changed: 27.10.2022
R?#19 R?#30 R?#32 R?#34 R?#37 = 0402-0.0625W-0R-100ppm±1%: as R?#8 on sheet mPCIe_LoRa_LTE_RS; Part Number: 0402-0.0625W-0R-100ppm±1%; Value: 0R; Temperature: -55°C~155°C; ComponentLink1Description: DATASHEET; ComponentLink1URL: https://www.chipdip.ru/product0/8000617426?ysclid=l7og5x0plo427794326; Datasheet: Datasheets/resistors/DOC012445956.pdf; Last changed: 27.10.2022
R?#21-R?#26 = 0402-0.0625W-10K-100ppm±5%: as R?#9 on sheet mPCIe_LoRa_LTE_RS; Part Number: 0402-0.0625W-10K-100ppm±5%; Value: 10K; Temperature: -55°C~155°C; ComponentLink1Description: DATASHEET; ComponentLink1URL: https://ru.mouser.com/ProductDetail/YAGEO/RC0402JR-0710KL?qs=%2Fha2pyFadugNN0LzwXn2qF8HRAp201xOpXu%252BapQnyvRGE%2F%252Bpr1TWjQ%3D%3D; Datasheet: Datasheets/resistors/PYu-RC_Group_51_RoHS_L_11.pdf; Last changed: 27.10.2022
VD?#3-VD?#5 = B5819W: Manufacturer: MDD; Check: False; Part Number: B5819W; Value: B5819W; NameFromManufacturer: B5819W
X?#8 = AAA-PCI-047-K01: as X?#1 on sheet mPCIe_LoRa_LTE_RS; Value: AAA-PCI-047-K01; Part Number: AAA-PCI-047-K01; NameFromManufacturer: AAA-PCI-047-K01; ComponentLink1Description: DATASHEET; Last changed: 24.03.2023

## Sheet LVDS_CSI.SchDoc
size 420 x 297 mm; Scale: 1:1; DocumentType: Схема электрическая принципиальная; SheetNumber: 19; SheetTotal: 23; DocumentTypeShort: Э3; DocumentInvertoryNumber: ㅤ
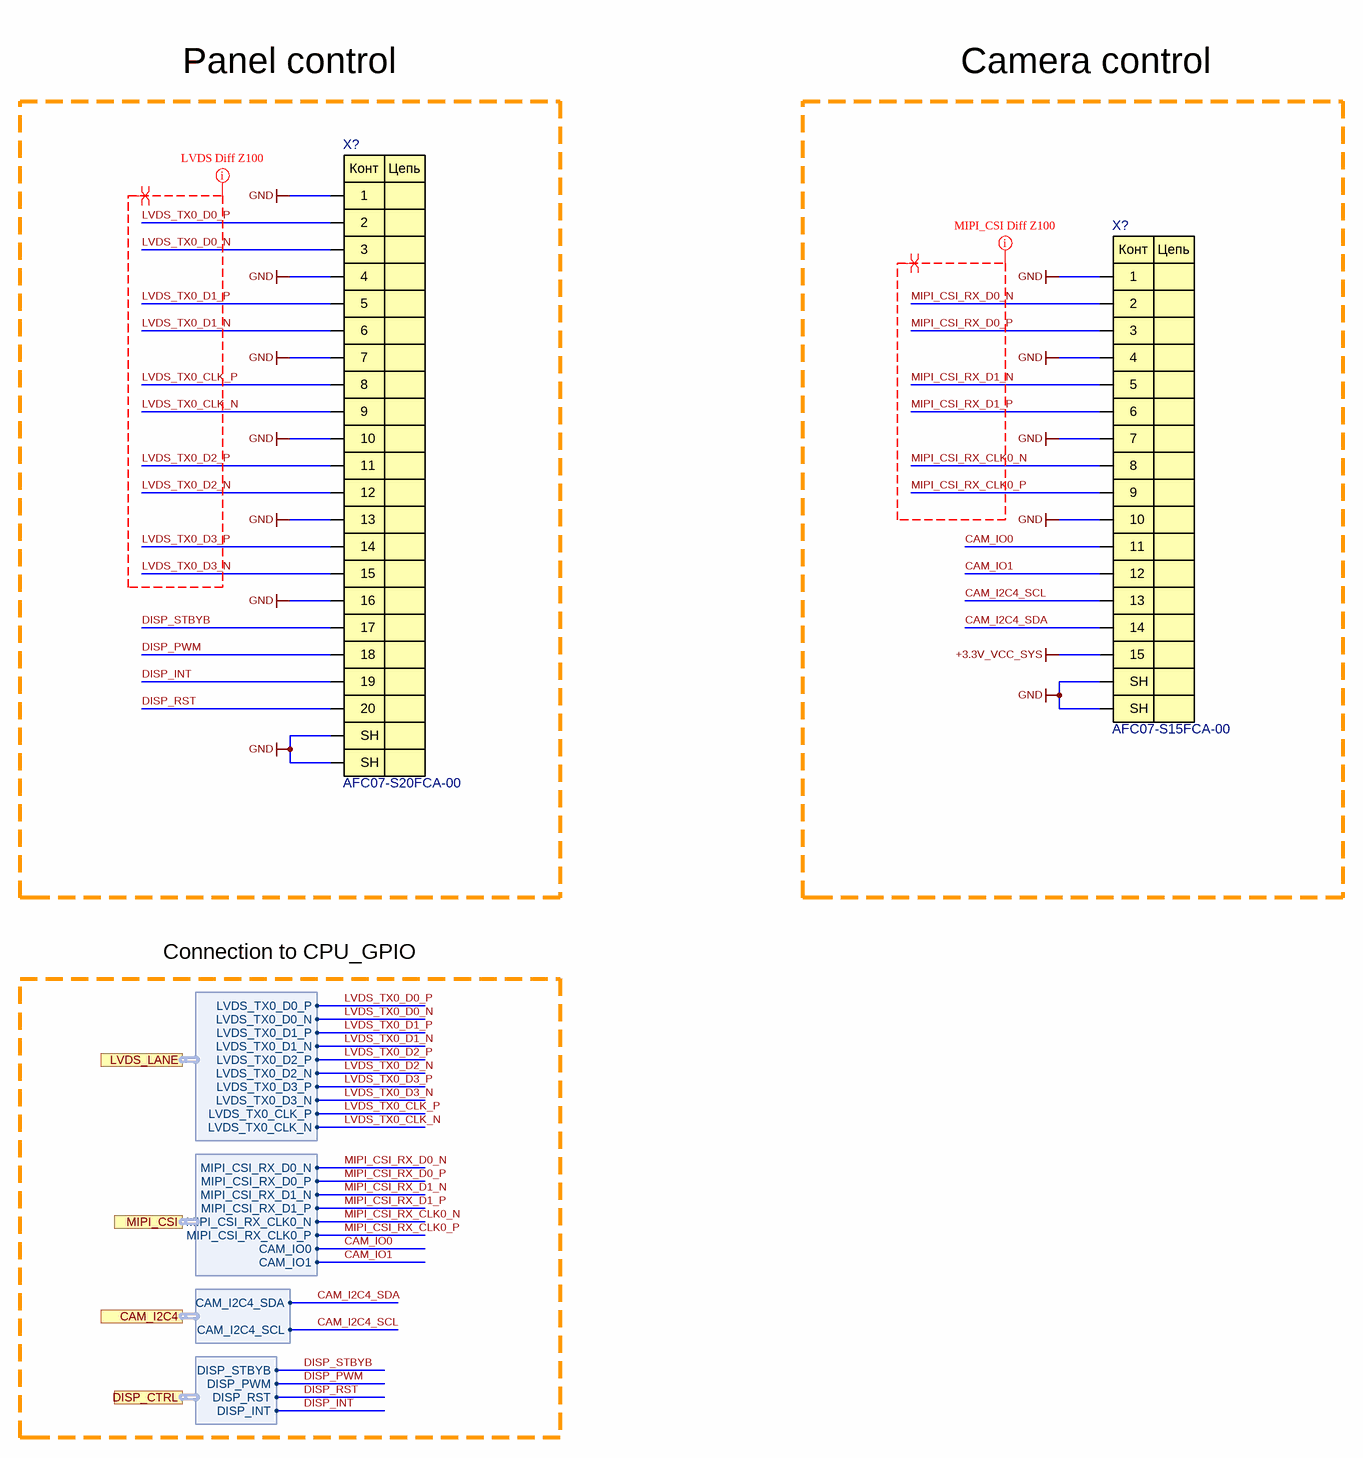
[diagram p25: LVDS_CSI.SchDoc]

### Parts
(Parts that share a designator on the sheet are numbered #1, #2 ... from top to bottom, then left to right.)
X?#9  AFC07-S20FCA-00  [AFC07-S20FCA-00]
X?#10  AFC07-S15FCA-00  [AFC07-S15FCA-00]

### Ports
CAM_I2C4 (harness CAM_I2C4), DISP_CTRL (harness DISP_CTRL), LVDS_LANE (harness LVDS_LANE), MIPI_CSI (harness MIPI_CSI)

### Harnesses
LVDS_LANE: LVDS_TX0_D2_N, LVDS_TX0_D3_N, LVDS_TX0_D3_P, LVDS_TX0_CLK_P, LVDS_TX0_CLK_N, LVDS_TX0_D2_P, LVDS_TX0_D1_N, LVDS_TX0_D1_P, LVDS_TX0_D0_N, LVDS_TX0_D0_P
MIPI_CSI: MIPI_CSI_RX_CLK0_N, MIPI_CSI_RX_CLK0_P, MIPI_CSI_RX_D1_P, MIPI_CSI_RX_D1_N, MIPI_CSI_RX_D0_P, MIPI_CSI_RX_D0_N, CAM_IO0, CAM_IO1
DISP_CTRL: DISP_STBYB, DISP_RST, DISP_PWM, DISP_INT
CAM_I2C4: CAM_I2C4_SCL, CAM_I2C4_SDA

### Nets
+3.3V_VCC_SYS: X?#10.15
GND: X?#9.1 X?#9.4 X?#9.7 X?#9.10 X?#9.13 X?#9.16 X?#9.M1(SH) X?#9.M2(SH) X?#10.1 X?#10.4 X?#10.7 X?#10.10 X?#10.M1(SH) X?#10.M2(SH)
CAM_I2C4_SCL: X?#10.13 ; port CAM_I2C4.CAM_I2C4_SCL
CAM_I2C4_SDA: X?#10.14 ; port CAM_I2C4.CAM_I2C4_SDA
CAM_IO0: X?#10.11 ; port MIPI_CSI.CAM_IO0
CAM_IO1: X?#10.12 ; port MIPI_CSI.CAM_IO1
DISP_INT: X?#9.19 ; port DISP_CTRL.DISP_INT
DISP_PWM: X?#9.18 ; port DISP_CTRL.DISP_PWM
DISP_RST: X?#9.20 ; port DISP_CTRL.DISP_RST
DISP_STBYB: X?#9.17 ; port DISP_CTRL.DISP_STBYB
LVDS_TX0_CLK_N: X?#9.9 ; port LVDS_LANE.LVDS_TX0_CLK_N
LVDS_TX0_CLK_P: X?#9.8 ; port LVDS_LANE.LVDS_TX0_CLK_P
LVDS_TX0_D0_N: X?#9.3 ; port LVDS_LANE.LVDS_TX0_D0_N
LVDS_TX0_D0_P: X?#9.2 ; port LVDS_LANE.LVDS_TX0_D0_P
LVDS_TX0_D1_N: X?#9.6 ; port LVDS_LANE.LVDS_TX0_D1_N
LVDS_TX0_D1_P: X?#9.5 ; port LVDS_LANE.LVDS_TX0_D1_P
LVDS_TX0_D2_N: X?#9.12 ; port LVDS_LANE.LVDS_TX0_D2_N
LVDS_TX0_D2_P: X?#9.11 ; port LVDS_LANE.LVDS_TX0_D2_P
LVDS_TX0_D3_N: X?#9.15 ; port LVDS_LANE.LVDS_TX0_D3_N
LVDS_TX0_D3_P: X?#9.14 ; port LVDS_LANE.LVDS_TX0_D3_P
MIPI_CSI_RX_CLK0_N: X?#10.8 ; port MIPI_CSI.MIPI_CSI_RX_CLK0_N
MIPI_CSI_RX_CLK0_P: X?#10.9 ; port MIPI_CSI.MIPI_CSI_RX_CLK0_P
MIPI_CSI_RX_D0_N: X?#10.2 ; port MIPI_CSI.MIPI_CSI_RX_D0_N
MIPI_CSI_RX_D0_P: X?#10.3 ; port MIPI_CSI.MIPI_CSI_RX_D0_P
MIPI_CSI_RX_D1_N: X?#10.5 ; port MIPI_CSI.MIPI_CSI_RX_D1_N
MIPI_CSI_RX_D1_P: X?#10.6 ; port MIPI_CSI.MIPI_CSI_RX_D1_P

### Layout directives
differential pair: LVDS_TX0_CLK_N, LVDS_TX0_CLK_P, LVDS_TX0_D0_N, LVDS_TX0_D0_P, LVDS_TX0_D1_N, LVDS_TX0_D1_P, LVDS_TX0_D2_N, LVDS_TX0_D2_P, LVDS_TX0_D3_N, LVDS_TX0_D3_P, MIPI_CSI_RX_CLK0_N, MIPI_CSI_RX_CLK0_P, MIPI_CSI_RX_D0_N, MIPI_CSI_RX_D0_P, MIPI_CSI_RX_D1_N, MIPI_CSI_RX_D1_P
net class LVDS: LVDS_TX0_CLK_N, LVDS_TX0_CLK_P, LVDS_TX0_D0_N, LVDS_TX0_D0_P, LVDS_TX0_D1_N, LVDS_TX0_D1_P, LVDS_TX0_D2_N, LVDS_TX0_D2_P, LVDS_TX0_D3_N, LVDS_TX0_D3_P
net class MIPI_CSI: MIPI_CSI_RX_CLK0_N, MIPI_CSI_RX_CLK0_P, MIPI_CSI_RX_D0_N, MIPI_CSI_RX_D0_P, MIPI_CSI_RX_D1_N, MIPI_CSI_RX_D1_P

### Notes on the sheet
- Panel control
- Camera control
- Connection to CPU_GPIO
- Подп. и дата
- Инв. № дубл.
- Взам. инв. №
- Инв. № подл.
- Изм.
- Лист
- № докум.
- Подп.
- Дата
- Копировал
- Формат А3
- (in symbol AFC07-S15FCA-00) Конт; Цепь
- (in symbol AFC07-S20FCA-00) Конт; Цепь

### Library data of the parts
X?#9 = AFC07-S20FCA-00: Slide Lock 20P Bottom Contact Surface Mount，Right Angle 0.5mm SMD,P=0.5mm,Surface Mount，Right Angle FFC/FPC Connectors; Manufacturer: JUSHUO; Check: False; Part Number: AFC07-S20FCA-00; Value: AFC07-S20FCA-00; NameFromManufacturer: AFC07-S20FCA-00
X?#10 = AFC07-S15FCA-00: lide Lock 15P Bottom Contact Surface Mount，Right Angle 0.5mm SMD,P=0.5mm,Surface Mount，Right Angle FFC/FPC Connectors; Manufacturer: JUSHUO; Check: False; Part Number: AFC07-S15FCA-00; Value: AFC07-S15FCA-00; NameFromManufacturer: AFC07-S15FCA-00

## Sheet Peripherals.SchDoc
size 420 x 297 mm; Scale: 1:1; DocumentType: Схема электрическая принципиальная; SheetNumber: 12; SheetTotal: 32; DocumentTypeShort: Э3; DocumentInvertoryNumber: ㅤ
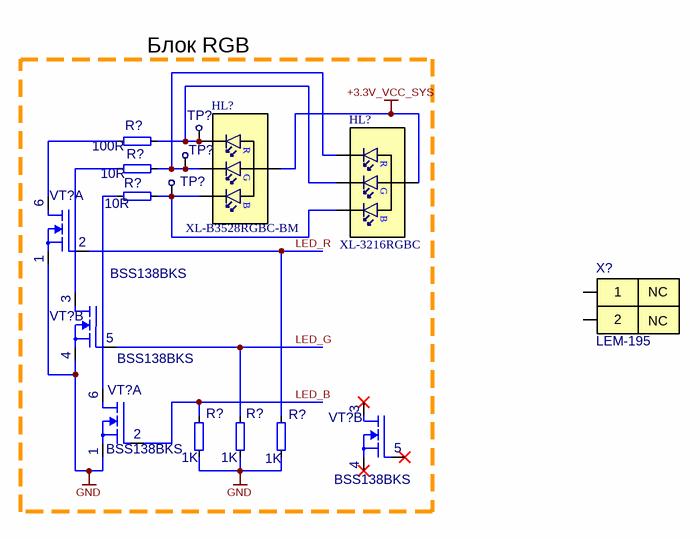
[diagram p26: Peripherals.SchDoc]

### Parts
(Parts that share a designator on the sheet are numbered #1, #2 ... from top to bottom, then left to right.)
HL?#1  XL-B3528RGBC-BM  [XL-B3528RGBC-BM]
HL?#2  XL-3216RGBC  [XL-3216RGBC]  (no BOM)
R?#40  100R  [R_0402]
R?#41  10R  [R_0402]
R?#42  10R  [R_0402]
R?#43  1K  [R_0402]
R?#44  1K  [R_0402]
R?#45  1K  [R_0402]
TP?#18  Тестовая точка  [TEST]  (value not drawn)  (no BOM)
TP?#19  Тестовая точка  [TEST]  (value not drawn)  (no BOM)
TP?#20  Тестовая точка  [TEST]  (value not drawn)  (no BOM)
VT?#1  BSS138BKS  [BSS138BKS.115]  (part A of 2)
VT?#2  BSS138BKS  [BSS138BKS.115]  (part B of 2)
VT?#3  BSS138BKS  [BSS138BKS.115]  (part A of 2)
VT?#4  BSS138BKS  [BSS138BKS.115]  (part B of 2)
X?#11  LEM-195  [LEM-195]

### Blocks framed on the sheet
Блок RGB: HL?#1 HL?#2 R?#40-R?#45 TP?#18-TP?#20 VT?#1-VT?#4

### Nets
+3.3V_VCC_SYS: HL?#1.2 HL?#2.3
GND: R?#43.1 R?#44.1 R?#45.1 VT?#1.1(S1) VT?#2.4(S2) VT?#3.1(S1)
LED_B: R?#43.2 VT?#3.2(G1)
LED_G: R?#44.2 VT?#2.5(G2)
LED_R: R?#45.2 VT?#1.2(G1)
NetHL?#1_1: HL?#1.1 HL?#2.4 R?#40.2 TP?#18.1
NetHL?#1_3: HL?#1.3 HL?#2.2 R?#41.2 TP?#19.1
NetHL?#1_4: HL?#1.4 HL?#2.1 R?#42.2 TP?#20.1
NetR?#40_1: R?#40.1 VT?#1.6(D1)
NetR?#41_1: R?#41.1 VT?#2.3(D2)
NetR?#42_1: R?#42.1 VT?#3.6(D1)

Not connected (* = marked no-connect by the designer): VT?#4 3(D2)* 4(S2)* 5(G2)*; X?#11 1 2

### Notes on the sheet
- Подп. и дата
- Инв. № дубл.
- Взам. инв. №
- Инв. № подл.
- Изм.
- Лист
- № докум.
- Подп.
- Дата
- Копировал
- Формат А3
- (in symbol LEM-195) NC
- (in symbol XL-3216RGBC) R; G; B
- (in symbol XL-B3528RGBC-BM) R; G; B

### Library data of the parts
HL?#1 = XL-B3528RGBC-BM: 20mA 无色透明透镜 -40℃~+85℃ Common anode 正贴 RGB 45mW SMD2835-4P Light Emitting Diodes (LED) ROHS; Manufacturer: XINGLIGHT; Check: False; Part Number: XL-B3528RGBC-BM; NameFromManufacturer: XL-B3528RGBC-BM; Value: XL-B3528RGBC-BM
HL?#2 = XL-3216RGBC: 25mA -30℃~+85℃ 正贴 RGB 120° 1206 Light Emitting Diodes (LED) ROHS; Manufacturer: XINGLIGHT; Check: False; Part Number: XL-3216RGBC; NameFromManufacturer: XL-3216RGBC; Value: XL-3216RGBC
R?#40 = 0402-0.0625W-100R-100ppm±1%: as R?#16 on sheet PCIE3; Part Number: 0402-0.0625W-100R-100ppm±1%; Value: 100R; Temperature: -55°C~155°C; ComponentLink1Description: DATASHEET; ComponentLink1URL: https://www.yageo.com/upload/media/product/productsearch/datasheet/rchip/PYu-RC_Group_51_RoHS_L_11.pdf; Datasheet: Datasheets/resistors/PYu-RC_Group_51_RoHS_L_11.pdf; Last changed: 27.10.2022
R?#41 R?#42 = 0402-0.0625W-10R-200ppm±1%: NameFromManufacturer: RC0402FR-0710RL; Manufacturer: Yageo; Place: S; Tolerance: 1%; Check: False; Part Number: 0402-0.0625W-10R-200ppm±1%; Value: 10R; Temperature: -55°C~155°C; ComponentLink1Description: DATASHEET; ComponentLink1URL: https://www.compel.ru/infosheet/YAG/RC0402FR-0710RL; Datasheet: Datasheets/resistors/PYu-RC_Group_51_RoHS_L_11.pdf; Last changed: 27.10.2022
R?#43-R?#45 = 0402-0.0625W-1K-100ppm±5%: NameFromManufacturer: RC0402JR-071KL; Manufacturer: Yageo; Place: S; Tolerance: 5%; Check: False; Annotation: *; Param: *; Value: 1K; Part Number: 0402-0.0625W-1K-100ppm±5%; Temperature: -55°C~155°C; ComponentLink1Description: DATASHEET; ComponentLink1URL: https://ru.mouser.com/ProductDetail/YAGEO/RC0402JR-071KL?qs=%2Fha2pyFadugNN0LzwXn2qBG%2Fxv0pCy6gh7Z%252B1hZJT2CnjLeHVORGDQ%3D%3D; Datasheet: #https://www.yageo.com/upload/media/product/productsearch/datasheet/rchip/PYu-RC_Group_51_RoHS_L_11.pdf#; Last changed: 12.10.2021
TP?#18-TP?#20 = Тестовая точка: *; Check: False; Part Number: Тестовая точка; Value: Тестовая точка; ComponentLink1Description: DATASHEET; Manufacturer: *
VT?#1-VT?#4 = BSS138BKS.115: Transistor MOSFET Array Dual N-CH 60V 320mA 6-Pin TSSOP T/R; Manufacturer: ElecSuper; Check: False; Part Number: BSS138BKS; Value: BSS138BKS; NameFromManufacturer: BSS138BKS
X?#11 = LEM-195: Manufacturer: Kang Yang; Check: False; Part Number: LEM-195; Value: LEM-195; NameFromManufacturer: LEM-195

## Nets that join several sheets
3.3V_VCC_DEVICE: PWR_MAIN (6 pins), AUDIO (15 pins), BMC (R268.1), CAN-FD (11 pins), Designator (11 pins)
+1.5V_mPCIe: PWR_CORE (6 pins), mPCIe_LoRa_LTE_RS (9 pins)
+3.3V_MCU: Flash_eMMC_MicroSD (14 pins), BMC (36 pins)
+3.3V_VCC_SYS: mPCIe_LoRa_LTE_RS (16 pins), PCIE3 (R?#21.1 R?#22.1 R?#23.1), LVDS_CSI (X?#10.15), Peripherals (HL?#1.2 HL?#2.3)
+12V_VCC_DEVICE: PWR_MAIN (6 pins), AUDIO (15 pins), BMC (R205.1)
+VDC_IN_MAIN: PWR_DC_IN (14 pins), PWR_MAIN (26 pins), PWR_PoE_PD_1000BASE-T (VD49.1)
GND: PWR_DC_IN (40 pins), PWR_MAIN (69 pins), PWR_PMIC (59 pins), PWR_CPU (303 pins), PWR_PoE_PD_1000BASE-T (8 pins), PWR_CORE (56 pins), CPU_LPDDR4 (9 pins), CPU_GPIO (21 pins), IC_LPDDR4 (91 pins), Flash_eMMC_MicroSD (47 pins), HDMI (19 pins), USB (21 pins), AUDIO (58 pins), BMC (62 pins), WIRELESS (28 pins), CAN-FD (11 pins), Designator (11 pins), mPCIe_LoRa_LTE_RS (74 pins), PCIE3 (45 pins), LVDS_CSI (14 pins), Peripherals (6 pins)
SH: PWR_PoE_PD_1000BASE-T (10 pins), HDMI (C252.2 R105.2), USB (C236.2 R95.2)
VCC5V0_DEVICE_S0: PWR_MAIN (6 pins), HDMI (5 pins), USB (C231.2 C239.2 D15.5 D16.12), BMC (R203.1)
VCC5V0_SYS_S5: PWR_DC_IN (VT14.3), PWR_MAIN (7 pins), PWR_PMIC (28 pins), PWR_CORE (13 pins), BMC (C436.2 D30.1 D30.3 R270.1)
VCC_1V1_NLDO_S3: PWR_PMIC (C83.1 C89.1 D3.9 D3.13), PWR_CORE (6 pins)
VCC_1V8_S3: PWR_MAIN (R53.2), PWR_PMIC (C106.1 C107.1 D3.5 L7.1), PWR_CORE (C501.1 VT27.3), CPU_GPIO (8 pins), IC_LPDDR4 (R6.1), Flash_eMMC_MicroSD (R64.2), BMC (C586.1 D43.OE D43.VCCA), WIRELESS (13 pins)
VCC_2V0_PLDO_S3: PWR_PMIC (C59.1 D3.59), PWR_CORE (6 pins)
VCC_3V3_S0: PWR_MAIN (R38.1 R49.1 R60.1), PWR_CORE (C505.1 C506.1 D39.1), CPU_GPIO (C260.2 D2.2N3 R189.2 R191.2), HDMI (5 pins), BMC (R269.1)
VCC_3V3_S3: PWR_MAIN (R54.1 R55.2 R56.2 VD7.2), PWR_PMIC (C108.1 C109.1 D3.24 L8.2), PWR_PoE_PD_1000BASE-T (R345.1), PWR_CORE (10 pins), CPU_GPIO (7 pins), Flash_eMMC_MicroSD (10 pins), WIRELESS (6 pins)
VCCA1V8_PLDO2_S0: PWR_PMIC (C61.2 D3.58), CPU_GPIO (C578.2 D2.2A10)
VCCA_1V8_S0: PWR_PMIC (C60.2 D3.60 R232.2), PWR_CPU (6 pins), CPU_LPDDR4 (C50.2 D2.2D2), CPU_GPIO (6 pins)
VCCIO_SD_S0: PWR_PMIC (C74.2 D3.65), CPU_GPIO (C259.2 D2.2A8)
VDD2_DDR_S3: PWR_PMIC (6 pins), IC_LPDDR4 (41 pins)
VDD_0V75_S3: PWR_PMIC (C84.2 D3.14), CPU_GPIO (C264.2 D2.2L2 D2.2L10)
VDD_CPU_BIG_S0: PWR_PMIC (7 pins), PWR_CPU (15 pins)
VDD_CPU_LIT_S0: PWR_PMIC (6 pins), PWR_CPU (9 pins)
VDD_DDR_S0: PWR_PMIC (6 pins), CPU_LPDDR4 (7 pins)
VDD_GPU_S0: PWR_PMIC (7 pins), PWR_CPU (9 pins)
VDD_LOGIC_S0: PWR_PMIC (7 pins), PWR_CPU (17 pins)
VDD_NPU_S0: PWR_PMIC (7 pins), PWR_CPU (9 pins)
VDDA_0V75_S0: PWR_PMIC (C95.2 D3.8), PWR_CPU (C154.2 D2.2G11), CPU_GPIO (C579.2 D2.2H11)
VDDA_1V2_S0: PWR_PMIC (C69.2 D3.57), CPU_GPIO (C255.2 D2.2M3)
VDDA_DDR_PLL_S0: PWR_PMIC (C85.2 D3.12), CPU_LPDDR4 (C49.2 D2.2C3)
VDDQ_DDR_CKE_S3: CPU_LPDDR4 (C51.2 D2.2B2), IC_LPDDR4 (R488.2)
VDDQ_DDR_S0: PWR_PMIC (6 pins), CPU_LPDDR4 (14 pins), IC_LPDDR4 (R4.1)
+5V_ON_OFF: PWR_DC_IN (R151.1), BMC (D28.66)
A_DRAM_CA0: CPU_LPDDR4 (D2.T1), IC_LPDDR4 (D1.H2)
A_DRAM_CA1: CPU_LPDDR4 (D2.1N1), IC_LPDDR4 (D1.J2)
A_DRAM_CA2: CPU_LPDDR4 (D2.1R3), IC_LPDDR4 (D1.H9)
A_DRAM_CA3: CPU_LPDDR4 (D2.1T2), IC_LPDDR4 (D1.H10)
A_DRAM_CA4: CPU_LPDDR4 (D2.1M5), IC_LPDDR4 (D1.H11)
A_DRAM_CA5: CPU_LPDDR4 (D2.1P5), IC_LPDDR4 (D1.J11)
A_DRAM_CKE0: CPU_LPDDR4 (D2.1N3), IC_LPDDR4 (D1.J4)
A_DRAM_CKE1: CPU_LPDDR4 (D2.1N5), IC_LPDDR4 (D1.J5)
A_DRAM_CLK_N: CPU_LPDDR4 (D2.P1), IC_LPDDR4 (D1.J9)
A_DRAM_CLK_P: CPU_LPDDR4 (D2.1L1), IC_LPDDR4 (D1.J8)
A_DRAM_CS0: CPU_LPDDR4 (D2.1R4), IC_LPDDR4 (D1.H4)
A_DRAM_CS1: CPU_LPDDR4 (D2.1T4), IC_LPDDR4 (D1.H3)
A_DRAM_DATA0: CPU_LPDDR4 (D2.W1), IC_LPDDR4 (D1.B2)
A_DRAM_DATA1: CPU_LPDDR4 (D2.1T1), IC_LPDDR4 (D1.C2)
A_DRAM_DATA2: CPU_LPDDR4 (D2.1P1), IC_LPDDR4 (D1.E2)
A_DRAM_DATA3: CPU_LPDDR4 (D2.U1), IC_LPDDR4 (D1.F2)
A_DRAM_DATA4: CPU_LPDDR4 (D2.1V3), IC_LPDDR4 (D1.F4)
A_DRAM_DATA5: CPU_LPDDR4 (D2.1W4), IC_LPDDR4 (D1.E4)
A_DRAM_DATA6: CPU_LPDDR4 (D2.AC1), IC_LPDDR4 (D1.C4)
A_DRAM_DATA7: CPU_LPDDR4 (D2.AB1), IC_LPDDR4 (D1.B4)
A_DRAM_DATA8: CPU_LPDDR4 (D2.AF1), IC_LPDDR4 (D1.B11)
A_DRAM_DATA9: CPU_LPDDR4 (D2.1AB1), IC_LPDDR4 (D1.C11)
A_DRAM_DATA10: CPU_LPDDR4 (D2.1AD1), IC_LPDDR4 (D1.E11)
A_DRAM_DATA11: CPU_LPDDR4 (D2.AH1), IC_LPDDR4 (D1.F11)
A_DRAM_DATA12: CPU_LPDDR4 (D2.1Y1), IC_LPDDR4 (D1.F9)
A_DRAM_DATA13: CPU_LPDDR4 (D2.1W2), IC_LPDDR4 (D1.E9)
A_DRAM_DATA14: CPU_LPDDR4 (D2.1AA3), IC_LPDDR4 (D1.C9)
A_DRAM_DATA15: CPU_LPDDR4 (D2.1AA1), IC_LPDDR4 (D1.B9)
A_DRAM_DATALINE.A_DRAM_DMI0: CPU_LPDDR4 (D2.1V1), IC_LPDDR4 (D1.C3)
A_DRAM_DATALINE.A_DRAM_DMI1: CPU_LPDDR4 (D2.AE1), IC_LPDDR4 (D1.C10)
A_DRAM_DATALINE.A_DRAM_DQS0_N: CPU_LPDDR4 (D2.Y1), IC_LPDDR4 (D1.E3)
A_DRAM_DATALINE.A_DRAM_DQS0_P: CPU_LPDDR4 (D2.1U1), IC_LPDDR4 (D1.D3)
A_DRAM_DATALINE.A_DRAM_DQS1_N: CPU_LPDDR4 (D2.1AB3), IC_LPDDR4 (D1.E10)
A_DRAM_DATALINE.A_DRAM_DQS1_P: CPU_LPDDR4 (D2.1AB4), IC_LPDDR4 (D1.D10)
B_DRAM_CA0: CPU_LPDDR4 (D2.L1), IC_LPDDR4 (D1.R2)
B_DRAM_CA1: CPU_LPDDR4 (D2.1J1), IC_LPDDR4 (D1.P2)
B_DRAM_CA2: CPU_LPDDR4 (D2.1J3), IC_LPDDR4 (D1.R9)
B_DRAM_CA3: CPU_LPDDR4 (D2.1G2), IC_LPDDR4 (D1.R10)
B_DRAM_CA4: CPU_LPDDR4 (D2.1F4), IC_LPDDR4 (D1.R11)
B_DRAM_CA5: CPU_LPDDR4 (D2.1K5), IC_LPDDR4 (D1.P11)
B_DRAM_CKE0: CPU_LPDDR4 (D2.1K2), IC_LPDDR4 (D1.P4)
B_DRAM_CKE1: CPU_LPDDR4 (D2.1M3), IC_LPDDR4 (D1.P5)
B_DRAM_CLK_N: CPU_LPDDR4 (D2.N1), IC_LPDDR4 (D1.P9)
B_DRAM_CLK_P: CPU_LPDDR4 (D2.1K1), IC_LPDDR4 (D1.P8)
B_DRAM_CS0: CPU_LPDDR4 (D2.1J5), IC_LPDDR4 (D1.R4)
B_DRAM_CS1: CPU_LPDDR4 (D2.1K4), IC_LPDDR4 (D1.R3)
B_DRAM_DATA0: CPU_LPDDR4 (D2.1D2), IC_LPDDR4 (D1.AA2)
B_DRAM_DATA1: CPU_LPDDR4 (D2.1F2), IC_LPDDR4 (D1.Y2)
B_DRAM_DATA2: CPU_LPDDR4 (D2.1G1), IC_LPDDR4 (D1.V2)
B_DRAM_DATA3: CPU_LPDDR4 (D2.K1), IC_LPDDR4 (D1.U2)
B_DRAM_DATA4: CPU_LPDDR4 (D2.1C3), IC_LPDDR4 (D1.U4)
B_DRAM_DATA5: CPU_LPDDR4 (D2.1B3), IC_LPDDR4 (D1.V4)
B_DRAM_DATA6: CPU_LPDDR4 (D2.A5), IC_LPDDR4 (D1.Y4)
B_DRAM_DATA7: CPU_LPDDR4 (D2.G1), IC_LPDDR4 (D1.AA4)
B_DRAM_DATA8: CPU_LPDDR4 (D2.1A1), IC_LPDDR4 (D1.AA11)
B_DRAM_DATA9: CPU_LPDDR4 (D2.B1), IC_LPDDR4 (D1.Y11)
B_DRAM_DATA10: CPU_LPDDR4 (D2.B2), IC_LPDDR4 (D1.V11)
B_DRAM_DATA11: CPU_LPDDR4 (D2.A2), IC_LPDDR4 (D1.U11)
B_DRAM_DATA12: CPU_LPDDR4 (D2.1E1), IC_LPDDR4 (D1.U9)
B_DRAM_DATA13: CPU_LPDDR4 (D2.1C1), IC_LPDDR4 (D1.V9)
B_DRAM_DATA14: CPU_LPDDR4 (D2.E1), IC_LPDDR4 (D1.Y9)
B_DRAM_DATA15: CPU_LPDDR4 (D2.D1), IC_LPDDR4 (D1.AA9)
B_DRAM_DATALINE.B_DRAM_DMI0: CPU_LPDDR4 (D2.B4), IC_LPDDR4 (D1.Y3)
B_DRAM_DATALINE.B_DRAM_DMI1: CPU_LPDDR4 (D2.1B1), IC_LPDDR4 (D1.Y10)
B_DRAM_DATALINE.B_DRAM_DQS0_N: CPU_LPDDR4 (D2.1F1), IC_LPDDR4 (D1.V3)
B_DRAM_DATALINE.B_DRAM_DQS0_P: CPU_LPDDR4 (D2.H1), IC_LPDDR4 (D1.W3)
B_DRAM_DATALINE.B_DRAM_DQS1_N: CPU_LPDDR4 (D2.B3), IC_LPDDR4 (D1.V10)
B_DRAM_DATALINE.B_DRAM_DQS1_P: CPU_LPDDR4 (D2.A3), IC_LPDDR4 (D1.W10)
BT_WAKE: CPU_GPIO (D2.1P23), WIRELESS (R399.2 VT33.3)
DRAM_ADDR_CTRL_CK.DRAM_RESETn: CPU_LPDDR4 (D2.1U5), IC_LPDDR4 (D1.T11 R2.1)
DWLD_DIS.eMMC_FSPI_DIS: Flash_eMMC_MicroSD (R68.2), BMC (D28.80)
EEPROM_CTRL.I2C6_SCL_M3: CPU_GPIO (D2.1AE1), Flash_eMMC_MicroSD (D14.1 R82.2)
EEPROM_CTRL.I2C6_SDA_M3: CPU_GPIO (D2.AJ1), Flash_eMMC_MicroSD (D14.3 R81.2)
EEPROM_WP.EEPROM_WP_MCU_0: Flash_eMMC_MicroSD (R84.1 R87.2 VT3.2), BMC (D28.85)
EEPROM_WP.EEPROM_WP_MCU_1: Flash_eMMC_MicroSD (R86.2), BMC (D28.86)
eMMC_CLKOUT: CPU_GPIO (D2.1G23), Flash_eMMC_MicroSD (R66.1)
eMMC_CMD: CPU_GPIO (D2.1F22), Flash_eMMC_MicroSD (D12.M5 R65.2)
eMMC_D0: CPU_GPIO (D2.E28), Flash_eMMC_MicroSD (D12.A3 R63.2 VT1.3)
eMMC_D1: CPU_GPIO (D2.E29), Flash_eMMC_MicroSD (D12.A4)
eMMC_D2: CPU_GPIO (D2.1C24), Flash_eMMC_MicroSD (D12.A5)
eMMC_D3: CPU_GPIO (D2.F28), Flash_eMMC_MicroSD (D12.B2)
eMMC_D4: CPU_GPIO (D2.1D24), Flash_eMMC_MicroSD (D12.B3)
eMMC_D5: CPU_GPIO (D2.G28), Flash_eMMC_MicroSD (D12.B4)
eMMC_D6: CPU_GPIO (D2.D28), Flash_eMMC_MicroSD (D12.B5)
eMMC_D7: CPU_GPIO (D2.1B24), Flash_eMMC_MicroSD (D12.B6)
eMMC_DATA_STROBE: CPU_GPIO (D2.1F23), Flash_eMMC_MicroSD (D12.H5 R70.1)
eMMC_RSTn: CPU_GPIO (D2.1D23), Flash_eMMC_MicroSD (D12.K5 R67.2)
HARD_RESETn: PWR_MAIN (D6.3), BMC (VT10.3)
I2C1_SCL_M0_RK806: PWR_PMIC (D3.17), CPU_GPIO (D2.1T22 R124.1)
I2C1_SDA_M0_RK806: PWR_PMIC (D3.15), CPU_GPIO (D2.1T23 R126.1)
I2C2_SCL_M0_CC_RTC: PWR_MAIN (D10.6 R55.1), CPU_GPIO (D2.1W24)
I2C2_SDA_M0_CC_RTC: PWR_MAIN (D10.5 R56.1), CPU_GPIO (D2.AB29)
PMIC_CTRL.PMIC_INT_L: PWR_PMIC (D3.19), CPU_GPIO (D2.1T21)
PMIC_CTRL.PMIC_PWR_CTRL1: PWR_PMIC (D3.62), CPU_GPIO (D2.Y28)
PMIC_CTRL.RESETn: PWR_MAIN (D6.7), PWR_PMIC (C113.2 D3.40), CPU_GPIO (C261.2 D2.W28 R118.1 R119.2)
PMIC_EXT_EN_OUT: PWR_PMIC (D3.39), PWR_CORE (R353.1 R354.1 R359.1 R360.1)
PMIC_PWR_CTRL2: PWR_PMIC (D3.61), PWR_CORE (VT28.1 VT29.1 VT30.1), CPU_GPIO (D2.1T24)
QSPI_CS: Flash_eMMC_MicroSD (D13.1 R74.1), BMC (D29.10)
QSPI_D0: Flash_eMMC_MicroSD (D13.5), BMC (D29.12)
QSPI_D1: Flash_eMMC_MicroSD (D13.2), BMC (D29.14)
QSPI_D2: Flash_eMMC_MicroSD (D13.3), BMC (D29.15)
QSPI_D3: Flash_eMMC_MicroSD (D13.7), BMC (D29.13)
QSPI_FLASH.QSPI_SCLK: Flash_eMMC_MicroSD (D13.6 VT2.3), BMC (D29.8)
RK628_HDMIRX_PWREN: PWR_CORE (R371.1), CPU_GPIO (D2.Y29)
RTC_32KHZ: PWR_MAIN (R52.2 R53.1), CPU_GPIO (D2.1U23), WIRELESS (R396.1)
RTC_CTRL.RTC_INT#: PWR_MAIN (R54.2 VD9.2), CPU_GPIO (D2.V29)
SD_DET.SDMMC0_DET: CPU_GPIO (R121.2 R123.2 R125.1), Flash_eMMC_MicroSD (VD11.1 X3.9)
SD_FSPI.SDMMC0_CLK_FSPI1_CLK: CPU_GPIO (D2.1B21), BMC (D31.1)
SD_FSPI.SDMMC0_CMD_FSPI1_CSN: CPU_GPIO (D2.1A21), BMC (D31.3)
SD_FSPI.SDMMC0_D0_FSPI1_D0: CPU_GPIO (D2.B24), BMC (D31.4)
SD_FSPI.SDMMC0_D1_FSPI1_D1: CPU_GPIO (D2.B25), BMC (D31.6)
SD_FSPI.SDMMC0_D2_FSPI1_D2: CPU_GPIO (D2.A23), BMC (D31.7)
SD_FSPI.SDMMC0_D3_FSPI1_D3: CPU_GPIO (D2.B23), BMC (D31.9)
SD_SDIO.SDMMC0_CLK: Flash_eMMC_MicroSD (R77.1), BMC (D31.8)
SD_SDIO.SDMMC0_CMD: Flash_eMMC_MicroSD (R76.1), BMC (D31.10)
SD_SDIO.SDMMC0_D0: Flash_eMMC_MicroSD (R78.1), BMC (D31.12)
SD_SDIO.SDMMC0_D1: Flash_eMMC_MicroSD (R79.1), BMC (D31.14)
SD_SDIO.SDMMC0_D2: Flash_eMMC_MicroSD (R73.1), BMC (D31.15)
SD_SDIO.SDMMC0_D3: Flash_eMMC_MicroSD (R75.1), BMC (D31.13)
SUPCAP_ON_OFF.VIN_SUPCAP_ON_OFF: PWR_DC_IN (R152.2), BMC (D28.67)
USB_OTG0_PWREN_H: CPU_GPIO (D2.AL3), USB (D15.4 R92.1)
WDT_CTRL.WDT_EN: PWR_MAIN (D6.5 R43.2), CPU_GPIO (D2.1Y24)
WDT_CTRL.WDT_WDI: PWR_MAIN (D6.6), CPU_GPIO (D2.1W21)
WL_BT_WAKE.WL_HOST_WAKE: CPU_GPIO (D2.1U22), WIRELESS (A2.13)

## Assembly variants
RK3576J-MB: all parts fitted